# Altium project UC-526.PrjPCB (part 2 of 2)

## Sheet Cyusb3314_Interface.SchDoc
size 401 x 330 mm
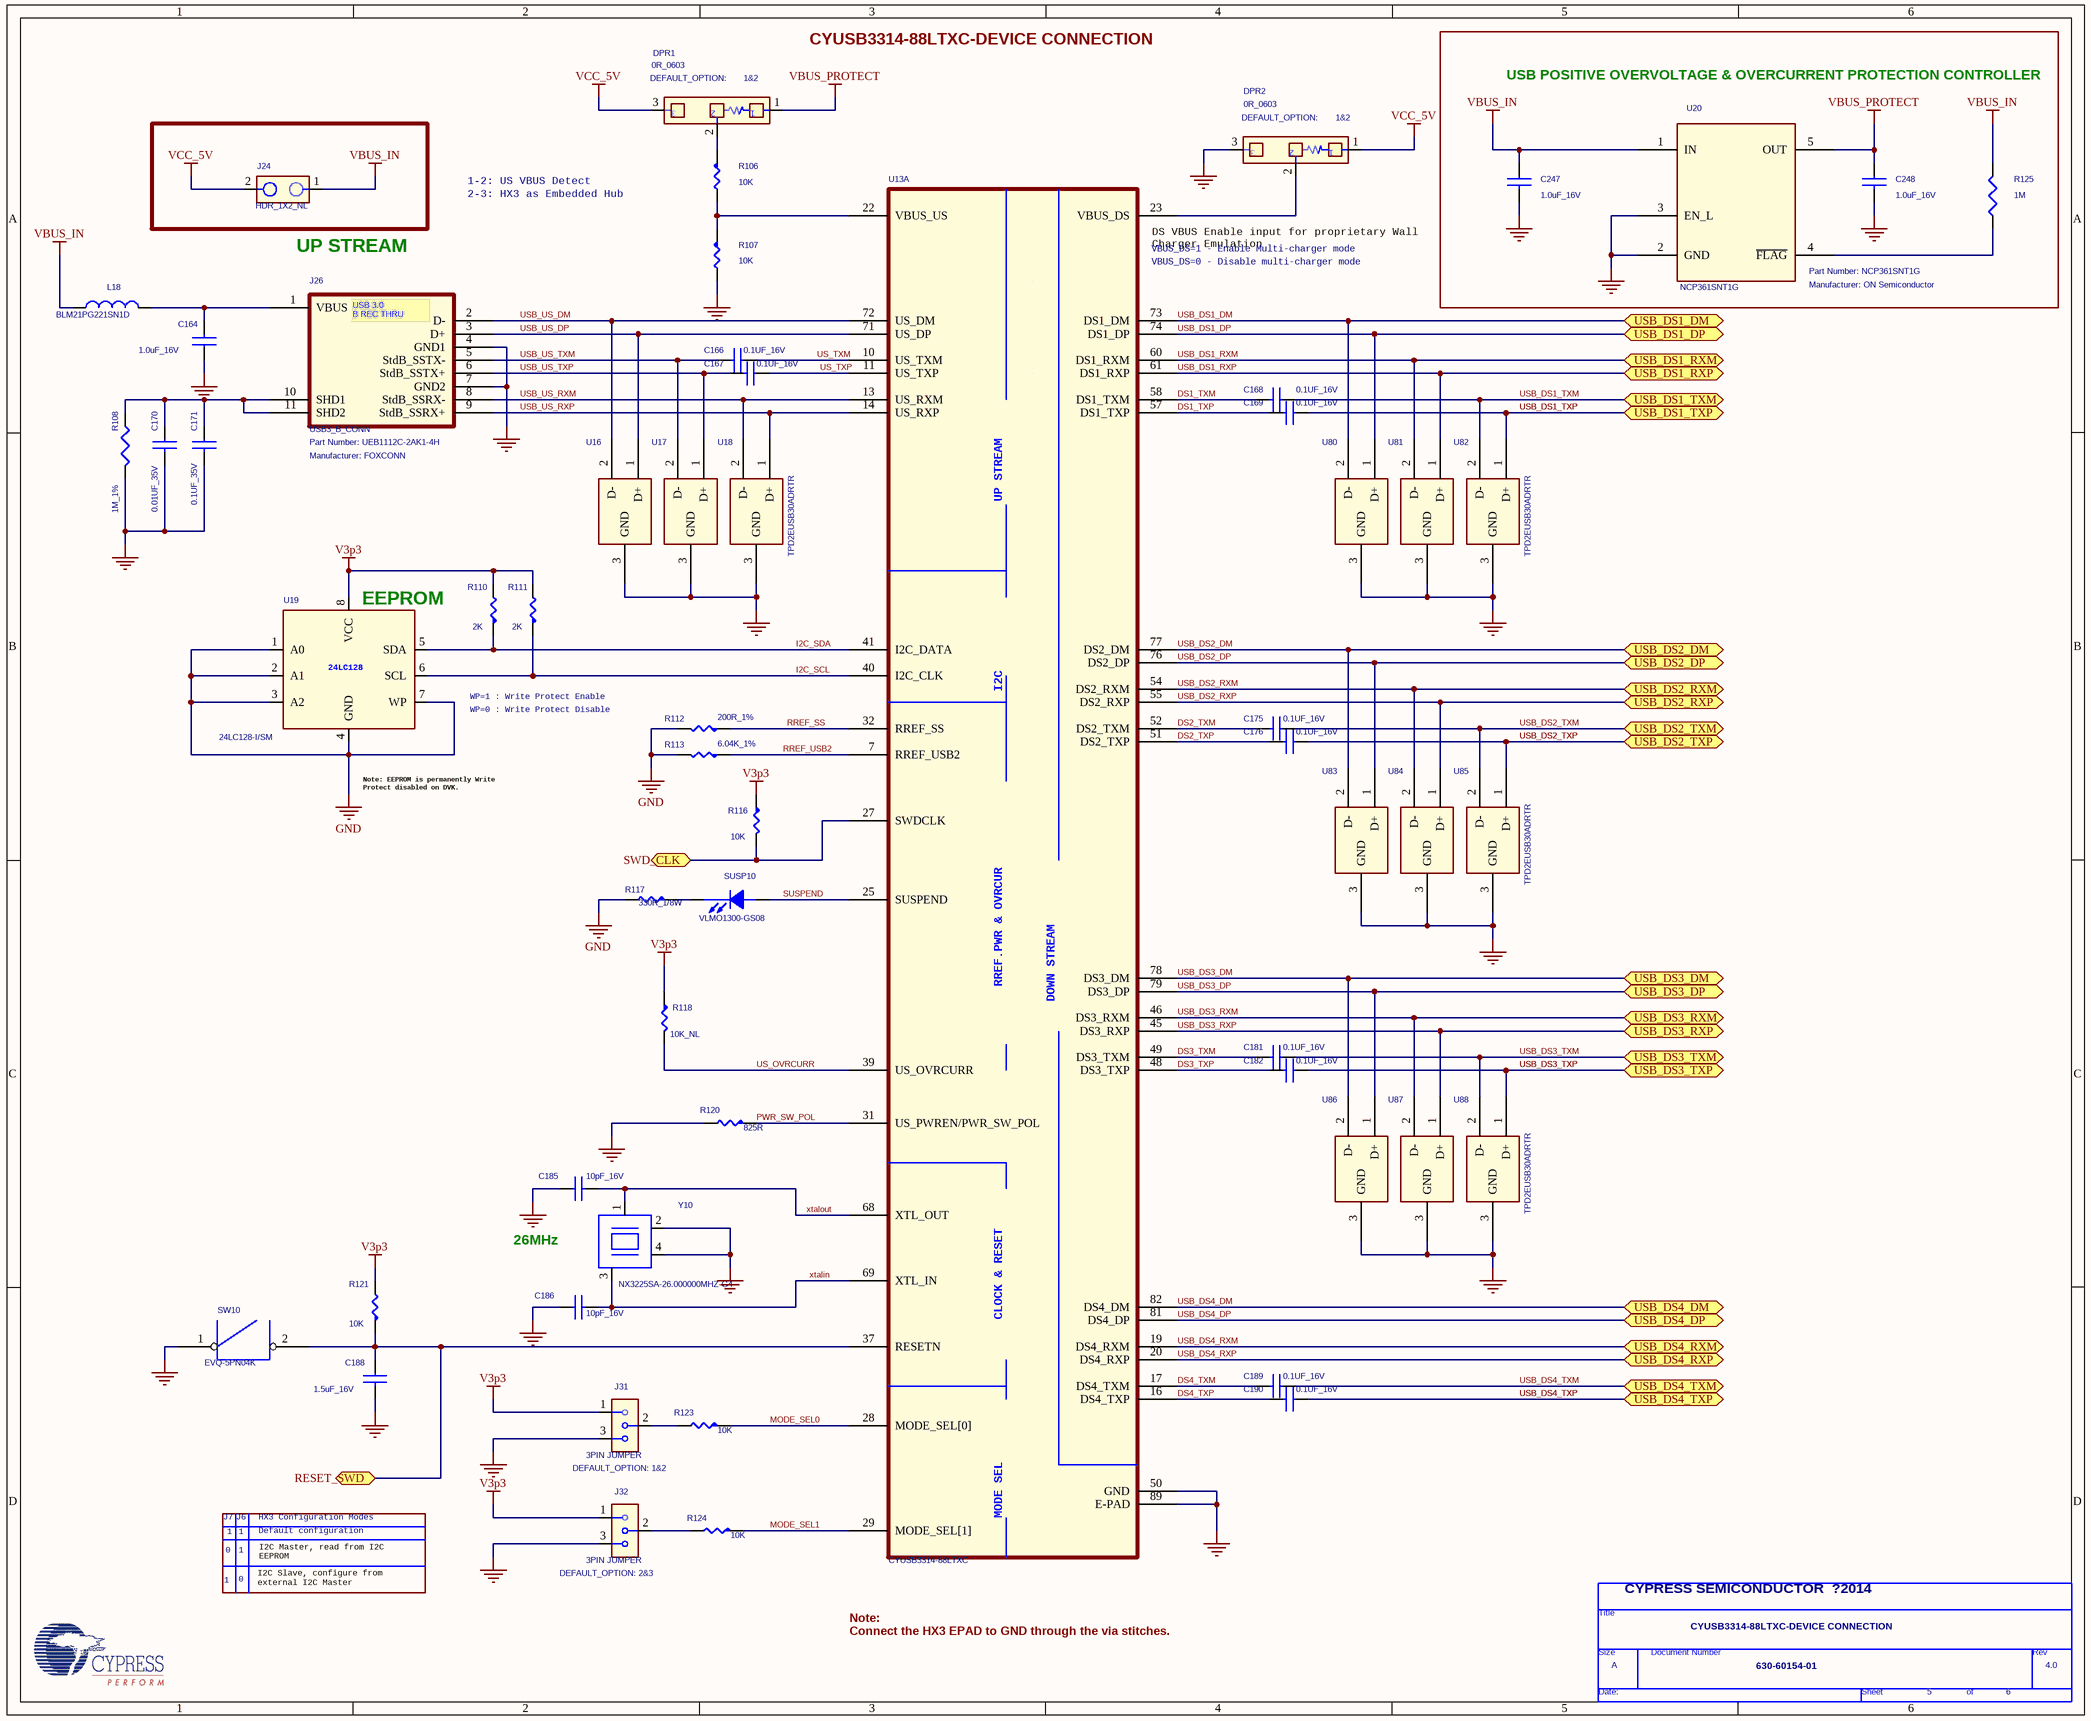
[diagram p5: Cyusb3314_Interface.SchDoc]

### Parts
(Parts that share a designator on the sheet are numbered #1, #2 ... from top to bottom, then left to right.)
*#2  Page Count: 6  Page Number: 5  Page Size: A  Title: CYUSB3314-88LTXC-DEVICE CONNECTION  RevCode: 4.0  Doc: 630-60154-01  (hidden comment: TitleBlock0)  (graphical)
C164  1.0uF_16V  [CAPC1005X56M]
C166  0.1UF_16V  [CAPC1005X56M]
C167  0.1UF_16V  [CAPC1005X56M]
C168  0.1UF_16V  [CAPC1005X56M]
C169  0.1UF_16V  [CAPC1005X56M]
C170  0.01UF_35V  [CAPC1005X55M]
C171  0.1UF_35V  [CAPC1005X55M]
C175  0.1UF_16V  [CAPC1005X56M]
C176  0.1UF_16V  [CAPC1005X56M]
C181  0.1UF_16V  [CAPC1005X56M]
C182  0.1UF_16V  [CAPC1005X56M]
C185  10pF_16V  [CAPC1608X90M]
C186  10pF_16V  [CAPC1608X90M]
C188  1.5uF_16V  [CAPC1608X90M]
C189  0.1UF_16V  [CAPC1005X56M]
C190  0.1UF_16V  [CAPC1005X56M]
C247  1.0uF_16V  [CAPC1608X90M]
C248  1.0uF_16V  [CAPC1608X90M]
DPR1  0R_0603  Mounting Status: 1&2  [RC0603_3P]
DPR2  0R_0603  Mounting Status: 1&2  [RC0603_3P]
J24  HDR_1X2_NL  [SAMTEC_TSW-102-08-G-S]
J26  USB3_B_CONN  Manufacturer: FOXCONN  [FOXCONN_UEB1112C-2AK1-4H]
J31  3PIN JUMPER  DEFAULT_OPTION: 1&2  [TE_3-644456-3]
J32  3PIN JUMPER  DEFAULT_OPTION: 2&3  [TE_3-644456-3]
L18  BLM21PG221SN1D  [INDC2012X105M]
R106  10K  [RESC1005X40M]
R107  10K  [RESC1005X40M]
R108  1M_1%  [RESC1608X55M]
R110  2K  [RESC1608X55M]
R111  2K  [RESC1608X55M]
R112  200R_1%  [RESC1608X50M]
R113  6.04K_1%  [RESC1608X55M_A]
R116  10K  [RESC1005X40M]
R117  330R_1/8W  [RESC1608X50M]
R118  10K_NL  [RESC1005X40M]
R120  825R  [RESC1005X40M]
R121  10K  [RESC1608X55M]
R123  10K  [RESC1005X40M]
R124  10K  [RESC1005X40M]
R125  1M  [RESC1005X40M]
SUSP10  VLMO1300-GS08  [LEDC1608X80M]
SW10  EVQ-5PN04K  [SW_EVQ-5PN04K]
U13  CYUSB3314-88LTXC  [QFN40P1000X1000X100-89M]  (part A of 3)
U16  TPD2EUSB30ADRTR  [SOTFL35P100X50-3M]  (value not drawn)
U17  TPD2EUSB30ADRTR  [SOTFL35P100X50-3M]  (value not drawn)
U18  TPD2EUSB30ADRTR  [SOTFL35P100X50-3M]
U19  24LC128-I/SM  [SOIC127P790X203-8M]
U20  NCP361SNT1G  Manufacturer: ON Semiconductor  [SOP95P275X110-5M]
U80  TPD2EUSB30ADRTR  [SOTFL35P100X50-3M]  (value not drawn)
U81  TPD2EUSB30ADRTR  [SOTFL35P100X50-3M]  (value not drawn)
U82  TPD2EUSB30ADRTR  [SOTFL35P100X50-3M]
U83  TPD2EUSB30ADRTR  [SOTFL35P100X50-3M]  (value not drawn)
U84  TPD2EUSB30ADRTR  [SOTFL35P100X50-3M]  (value not drawn)
U85  TPD2EUSB30ADRTR  [SOTFL35P100X50-3M]
U86  TPD2EUSB30ADRTR  [SOTFL35P100X50-3M]  (value not drawn)
U87  TPD2EUSB30ADRTR  [SOTFL35P100X50-3M]  (value not drawn)
U88  TPD2EUSB30ADRTR  [SOTFL35P100X50-3M]
Y10  NX3225SA-26.000000MHZ-G4  [OSCCC250X320X70-4M]

### Blocks framed on the sheet
USB POSITIVE OVERVOLTAGE & OVERCURRENT PROTECTION CONTROLLER: C247 C248 R125 U20

### Ports
RESET_SWD (bidir), SWD_CLK (bidir), USB_DS1_DM (bidir), USB_DS1_DP (bidir), USB_DS1_RXM (bidir), USB_DS1_RXP (bidir), USB_DS1_TXM (bidir), USB_DS1_TXP (bidir), USB_DS2_DM (bidir), USB_DS2_DP (bidir), USB_DS2_RXM (bidir), USB_DS2_RXP (bidir), USB_DS2_TXM (bidir), USB_DS2_TXP (bidir), USB_DS3_DM (bidir), USB_DS3_DP (bidir), USB_DS3_RXM (bidir), USB_DS3_RXP (bidir), USB_DS3_TXM (bidir), USB_DS3_TXP (bidir), USB_DS4_DM (bidir), USB_DS4_DP (bidir), USB_DS4_RXM (bidir), USB_DS4_RXP (bidir), USB_DS4_TXM (bidir), USB_DS4_TXP (bidir)

### Nets
GND: C164.1 C170.2 C171.2 C185.1 C186.1 C188.2 C247.2 C248.2 DPR2.3 J26.4(GND1) J26.7(GND2) J31.3 J32.3 R107.2 R108.2 R112.2 R113.2 R117.2 R120.2 SW10.1 U13.50(GND) U13.89(E-PAD) U16.3(GND) U17.3(GND) U18.3(GND) U19.1(A0) U19.2(A1) U19.3(A2) U19.4(GND) U19.7(WP) U20.2(GND) U20.3(EN_L) U80.3(GND) U81.3(GND) U82.3(GND) U83.3(GND) U84.3(GND) U85.3(GND) U86.3(GND) U87.3(GND) U88.3(GND) Y10.2 Y10.4
V3p3: J31.1 J32.1 R110.2 R111.2 R116.1 R118.1 R121.2 U19.8(VCC)  [project net SWD_IO]
VBUS_IN: C247.1 J24.1 L18.1 R125.2 U20.1(IN)
VBUS_PROTECT: C248.1 DPR1.1 U20.5(OUT)
VCC_5V: DPR1.3 DPR2.1 J24.2  [project net VCC(+5V)]
DS1_TXM: C168.2 U13.58(DS1_TXM)
DS1_TXP: C169.2 U13.57(DS1_TXP)
DS2_TXM: C175.2 U13.52(DS2_TXM)
DS2_TXP: C176.2 U13.51(DS2_TXP)
DS3_TXM: C181.2 U13.49(DS3_TXM)
DS3_TXP: C182.2 U13.48(DS3_TXP)
DS4_TXM: C189.2 U13.17(DS4_TXM)
DS4_TXP: C190.2 U13.16(DS4_TXP)
I2C_SCL: R111.1 U13.40(I2C_CLK) U19.6(SCL)
I2C_SDA: R110.1 U13.41(I2C_DATA) U19.5(SDA)
MODE_SEL0: R123.1 U13.28(MODE_SEL[0])
MODE_SEL1: R124.1 U13.29(MODE_SEL[1])
PWR_SW_POL: R120.1 U13.31(US_PWREN/PWR_SW_POL)
RREF_SS: R112.1 U13.32(RREF_SS)
RREF_USB2: R113.1 U13.7(RREF_USB2)
SUSPEND: SUSP10.1(ANODE) U13.25(SUSPEND)
US_OVRCURR: R118.2 U13.39(US_OVRCURR)
US_TXM: C166.1 U13.10(US_TXM)
US_TXP: C167.1 U13.11(US_TXP)
USB_DS1_DM: U13.73(DS1_DM) U80.2(D-) ; port USB_DS1_DM
USB_DS1_DP: U13.74(DS1_DP) U80.1(D+) ; port USB_DS1_DP
USB_DS1_RXM: U13.60(DS1_RXM) U81.2(D-) ; port USB_DS1_RXM
USB_DS1_RXP: U13.61(DS1_RXP) U81.1(D+) ; port USB_DS1_RXP
USB_DS1_TXM: C168.1 U82.2(D-) ; port USB_DS1_TXM
USB_DS1_TXP: C169.1 U82.1(D+) ; port USB_DS1_TXP
USB_DS2_DM: U13.77(DS2_DM) U83.2(D-) ; port USB_DS2_DM
USB_DS2_DP: U13.76(DS2_DP) U83.1(D+) ; port USB_DS2_DP
USB_DS2_RXM: U13.54(DS2_RXM) U84.2(D-) ; port USB_DS2_RXM
USB_DS2_RXP: U13.55(DS2_RXP) U84.1(D+) ; port USB_DS2_RXP
USB_DS2_TXM: C175.1 U85.2(D-) ; port USB_DS2_TXM
USB_DS2_TXP: C176.1 U85.1(D+) ; port USB_DS2_TXP
USB_DS3_DM: U13.78(DS3_DM) U86.2(D-) ; port USB_DS3_DM
USB_DS3_DP: U13.79(DS3_DP) U86.1(D+) ; port USB_DS3_DP
USB_DS3_RXM: U13.46(DS3_RXM) U87.2(D-) ; port USB_DS3_RXM
USB_DS3_RXP: U13.45(DS3_RXP) U87.1(D+) ; port USB_DS3_RXP
USB_DS3_TXM: C181.1 U88.2(D-) ; port USB_DS3_TXM
USB_DS3_TXP: C182.1 U88.1(D+) ; port USB_DS3_TXP
USB_DS4_DM: U13.82(DS4_DM) ; port USB_DS4_DM
USB_DS4_DP: U13.81(DS4_DP) ; port USB_DS4_DP  [project net USB_DS4_DM]
USB_DS4_RXM: U13.19(DS4_RXM) ; port USB_DS4_RXM
USB_DS4_RXP: U13.20(DS4_RXP) ; port USB_DS4_RXP
USB_DS4_TXM: C189.1 ; port USB_DS4_TXM
USB_DS4_TXP: C190.1 ; port USB_DS4_TXP
USB_US_DM: J26.2(D-) U13.72(US_DM) U16.2(D-)
USB_US_DP: J26.3(D+) U13.71(US_DP) U16.1(D+)
USB_US_RXM: J26.8(StdB_SSRX-) U13.13(US_RXM) U18.2(D-)
USB_US_RXP: J26.9(StdB_SSRX+) U13.14(US_RXP) U18.1(D+)
USB_US_TXM: C166.2 J26.5(StdB_SSTX-) U17.2(D-)
USB_US_TXP: C167.2 J26.6(StdB_SSTX+) U17.1(D+)
xtalin: C186.2 U13.69(XTL_IN) Y10.3
xtalout: C185.2 U13.68(XTL_OUT) Y10.1
NetC164_2: C164.2 J26.1(VBUS) L18.2
NetC170_1: C170.1 C171.1 J26.10(SHD1) J26.11(SHD2) R108.1
NetC188_1: C188.1 R121.1 SW10.2 U13.37(RESETN) ; port RESET_SWD
NetDPR1_2: DPR1.2 R106.1
NetDPR2_2: DPR2.2 U13.23(VBUS_DS)
NetJ11_4: R116.2 U13.27(SWDCLK) ; port SWD_CLK
NetJ31_2: J31.2 R123.2
NetJ32_2: J32.2 R124.2
NetR106_2: R106.2 R107.1 U13.22(VBUS_US)
NetR117_1: R117.1 SUSP10.2(CATHODE)
NetR125_1: R125.1 U20.4(~{FLAG})

### Notes on the sheet
- CYUSB3314-88LTXC-DEVICE CONNECTION
- 1-2: US VBUS Detect
- 2-3: HX3 as Embedded Hub
- UP STREAM
- (near U13) DS VBUS Enable input for proprietary Wall
  Charger Emulation
- (near U13) VBUS_DS=0 - Disable multi-charger mode
- (near U13) VBUS_DS=1 - Enable Multi-charger mode
- (near U19) EEPROM
- WP=1 : Write Protect Enable
- WP=0 : Write Protect Disable
- (near U19) Note: EEPROM is permanently Write
  Protect disabled on DVK.
- 26MHz
- J7
- 1
- J6
- HX3 Configuration Modes
- Default configuration
- 0
- I2C Slave, configure from
  external I2C Master
- I2C Master, read from I2C
  EEPROM
- (near *#2) CYPRESS SEMICONDUCTOR  ?2014
- Note:
  Connect the HX3 EPAD to GND through the via stitches.
- (in symbol CYUSB3314-88LTXC_2, part A) UP STREAM; I2C; RREF.PWR & OVRCUR; DOWN STREAM; CLOCK & RESET; MODE SEL
- (in symbol TitleBlock0) Title; Size; Document Number; Rev; Date:; Sheet; of
- (in symbol UEB1112C-2AK1-4H) USB 3.0 / B REC THRU

### Library data of the parts
C164 C166-C169 C175 C176 C181 C182 C185 C186 C189 C190 = CAPACITOR NON-POL
  C164 C175 C176 C189 C190: Manufacturer: *; Part Number: *
  C181: Manufacturer: *
C170 = CAPACITOR NON-POL: Part Number: C1005X7R1V103M050BB; Manufacturer: *
C171 = CAPACITOR NON-POL: Part Number: C1005X7R1V104K050BB
C188 = CAPACITOR NON-POL: CAP CER 1.5UF 10V 10% X7R 0805; Manufacturer: TDK Corporation; Lead Free: YES
C247 C248 = CAP: CAP - CER, 1uF, 10V, +/-10%, X5R, 0402; Part Class: CAPACITORS; Num Pins: 2; Item Num: P03-15479R; RoHS Compliant: Yes; Lead Free Status: Yes
DPR1 DPR2 = DPR12_0: Resistor, 4.7K, 0402, 1/10W, 5%; Part Number: ERJ-2GEJ472X
J24 = HEADER_1x2: Manufacturer: Samtec Inc; Part Number: TSW-102-08-G-S; Lead Free: YES
J26 = UEB1112C-2AK1-4H: USB 3.0 B Series Right Angle,T/H 9 Pos; Lead Free: YES; Part Number: UEB1112C-2AK1-4H
J31 J32 = 3PIN JUM: CONN HEADER VERT 3POS .100 TIN; Part Number: 3-644456-3; Manufacturer: Tyco Electronics; Type: Single Row,3Pin Header
L18 = INDUCTOR: FERRITE CHIP 220 OHM 2A 0805; Manufacturer: Murata; Lead Free: YES; Part Number: BLM21PG221SN1D
R106 = R_Dup1: Manufacturer: Panasonic; Part Number: ERJ-2GE0R00X
R107 = R_Dup1: Part Number: ERJ-2RKF4990X; Manufacturer: Panasonic
R108 = R: RES 1M OHM 1/10W 1% 0603 SMD; Part Number: ERJ-3EKF1004V; Manufacturer: Panasonic
R110 = R_Dup1: RES 2.00K OHM 1/10W 1% 0603 SMD; Manufacturer: Rohm Semiconductor; Part Number: MCR03EZPFX2001; Lead Free: YES
R111 = R_Dup1: RES 2.00K OHM 1/10W 1% 0603 SMD; Part Number: MCR03EZPFX2001; Manufacturer: Rohm Semiconductor; Lead Free: YES
R112 = R_Dup1: RES 200 OHM 1% 0603 SMD; Manufacturer: Stackpole; Part Number: RNCP0603FTD200R
R113 = R_Dup1: RES 6.04K OHM .25W 1% 0603 SMD; Part Number: CRCW06036K04FKEAHP; Manufacturer: Vishay Dale
R116 = R_Dup1: RES 10.0K OHM 1/10W 1% 0603 SMD; Manufacturer: Panasonic - ECG; Part Number: ERJ-3EKF1002V; Lead Free: YES
R117 = R_Dup1: Lead Free: YES
R118 = R_Dup1: RES 10.0K OHM 1/10W 1% 0603 SMD; Part Number: ERJ-3EKF1002V; Manufacturer: Panasonic - ECG; Lead Free: YES
R120 R123 R124 = R_Dup1: Manufacturer: Panasonic; Part Number: ERJ-2RKF49.9X
R121 = R_Dup1: Part Number: ERJ-2RKF49.9X; Manufacturer: Panasonic
R125 = R: RES 1.00M OHM 1/10W 1% 0402 SMD; Manufacturer: Panasonic; Part Number: ERJ-2RKF1004X
SUSP10 = LED: Part Number: VLMO1300-GS08
SW10 = B3U1000P: Part Number: EVQ-5PN04K
U13 = CYUSB3314-88LTXC_2: Part Number: CYUSB3314-88LTXC
U19 = 24LC128: IC EEPROM 128KBIT 400KHZ 8SOIC; Manufacturer: Microchip Technology; Lead Free: YES; Part Number: 24LC128-I/SM
U20 = NCP361SNT1G_0: IC USB POS OVP/OC_TSOP5; Part Number: NCP361SNT1G
Y10 = CRYSTAL_1: Manufacturer: NDK; Part Number: NX3225SA-26.000000MHZ-G4
*#2 = TitleBlock0: Page Create Date: March  8, 1995
U16-U18 U80-U88 = TPD2EUSB30ADRTR: Part Number: TPD2EUSB30ADRTR

## Sheet Cyusb3314_Power.SchDoc
size 386 x 284 mm
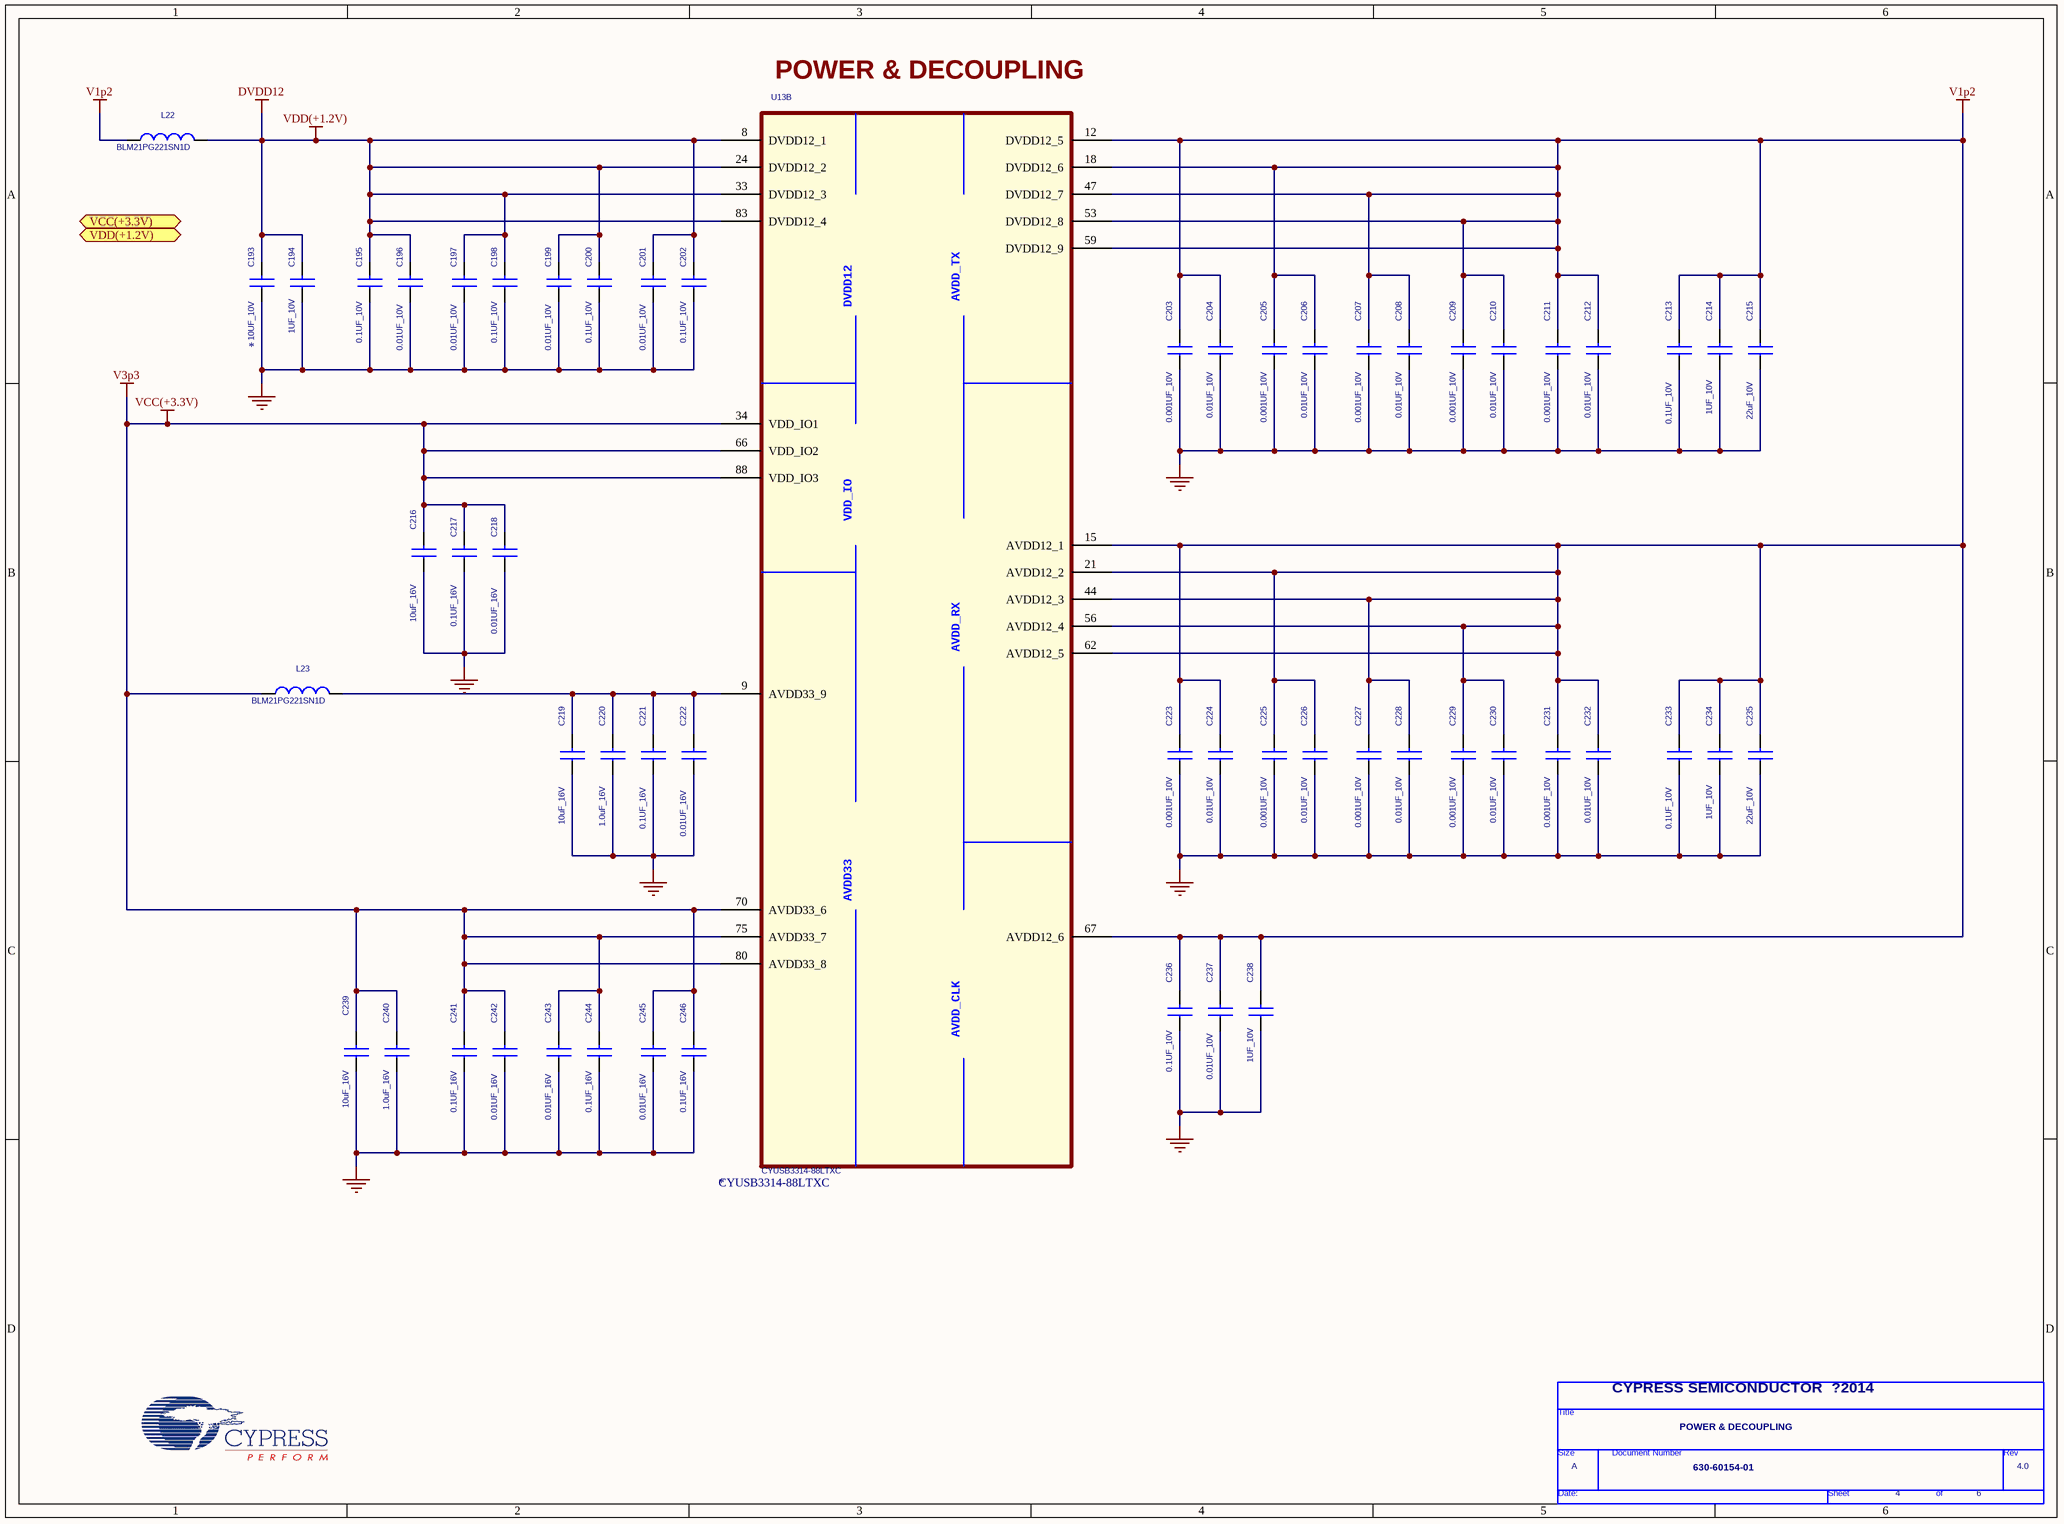
[diagram p6: Cyusb3314_Power.SchDoc]

### Parts
(Parts that share a designator on the sheet are numbered #1, #2 ... from top to bottom, then left to right.)
*#3  Page Count: 6  Page Number: 4  Page Size: A  Title: POWER & DECOUPLING  RevCode: 4.0  Doc: 630-60154-01  (hidden comment: TitleBlock0)  (graphical)
C193  10UF_10V  [CAPC1608X90M]
C194  1UF_10V  [CAPC1005X56M]
C195  0.1UF_10V  [CAPC1005X56M]
C196  0.01UF_10V  [CAPC1005X56M]
C197  0.01UF_10V  [CAPC1005X56M]
C198  0.1UF_10V  [CAPC1005X56M]
C199  0.01UF_10V  [CAPC1005X56M]
C200  0.1UF_10V  [CAPC1005X56M]
C201  0.01UF_10V  [CAPC1005X56M]
C202  0.1UF_10V  [CAPC1005X56M]
C203  0.001UF_10V  [CAPC1005X56M]
C204  0.01UF_10V  [CAPC1005X56M]
C205  0.001UF_10V  [CAPC1005X56M]
C206  0.01UF_10V  [CAPC1005X56M]
C207  0.001UF_10V  [CAPC1005X56M]
C208  0.01UF_10V  [CAPC1005X56M]
C209  0.001UF_10V  [CAPC1005X56M]
C210  0.01UF_10V  [CAPC1005X56M]
C211  0.001UF_10V  [CAPC1005X56M]
C212  0.01UF_10V  [CAPC1005X56M]
C213  0.1UF_10V  [CAPC1005X56M]
C214  1UF_10V  [CAPC1005X56M]
C215  22uF_10V  [CAPC1608X90M]
C216  10uF_16V  [CAPC1608X90M]
C217  0.1UF_16V  [CAPC1005X56M]
C218  0.01UF_16V  [CAPC1005X56M]
C219  10uF_16V  [CAPC1608X90M]
C220  1.0uF_16V  [CAPC1005X56M]
C221  0.1UF_16V  [CAPC1005X56M]
C222  0.01UF_16V  [CAPC1005X56M]
C223  0.001UF_10V  [CAPC1005X56M]
C224  0.01UF_10V  [CAPC1005X56M]
C225  0.001UF_10V  [CAPC1005X56M]
C226  0.01UF_10V  [CAPC1005X56M]
C227  0.001UF_10V  [CAPC1005X56M]
C228  0.01UF_10V  [CAPC1005X56M]
C229  0.001UF_10V  [CAPC1005X56M]
C230  0.01UF_10V  [CAPC1005X56M]
C231  0.001UF_10V  [CAPC1005X56M]
C232  0.01UF_10V  [CAPC1005X56M]
C233  0.1UF_10V  [CAPC1005X56M]
C234  1UF_10V  [CAPC1005X56M]
C235  22uF_10V  [CAPC1608X90M]
C236  0.1UF_10V  [CAPC1005X56M]
C237  0.01UF_10V  [CAPC1005X56M]
C238  1UF_10V  [CAPC1005X56M]
C239  10uF_16V  [CAPC1608X90M]
C240  1.0uF_16V  [CAPC1005X56M]
C241  0.1UF_16V  [CAPC1005X56M]
C242  0.01UF_16V  [CAPC1005X56M]
C243  0.01UF_16V  [CAPC1005X56M]
C244  0.1UF_16V  [CAPC1005X56M]
C245  0.01UF_16V  [CAPC1005X56M]
C246  0.1UF_16V  [CAPC1005X56M]
L22  BLM21PG221SN1D  [INDC2012X105M]
L23  BLM21PG221SN1D  [INDC2012X105M]
U13  CYUSB3314-88LTXC  [QFN40P1000X1000X100-89M]  (part B of 3)

### Ports
VCC(+3.3V) (in), VDD(+1.2V) (in)

### Nets
DVDD12: C193.2 C194.2 C195.2 C196.2 C197.2 C198.2 C199.2 C200.2 C201.2 C202.2 C203.2 C204.2 C205.2 C206.2 C207.2 C208.2 C209.2 C210.2 C211.2 C212.2 C213.2 C214.2 C215.2 C223.2 C224.2 C225.2 C226.2 C227.2 C228.2 C229.2 C230.2 C231.2 C232.2 C233.2 C234.2 C235.2 C236.2 C237.2 C238.2 L22.1 L22.2 U13.8(DVDD12_1) U13.12(DVDD12_5) U13.15(AVDD12_1) U13.18(DVDD12_6) U13.21(AVDD12_2) U13.24(DVDD12_2) U13.33(DVDD12_3) U13.44(AVDD12_3) U13.47(DVDD12_7) U13.53(DVDD12_8) U13.56(AVDD12_4) U13.59(DVDD12_9) U13.62(AVDD12_5) U13.67(AVDD12_6) U13.83(DVDD12_4)  [also labelled V1p2, VDD(+1.2V)]
GND: C193.1 C194.1 C195.1 C196.1 C197.1 C198.1 C199.1 C200.1 C201.1 C202.1 C203.1 C204.1 C205.1 C206.1 C207.1 C208.1 C209.1 C210.1 C211.1 C212.1 C213.1 C214.1 C215.1 C216.1 C217.1 C218.1 C219.1 C220.1 C221.1 C222.1 C223.1 C224.1 C225.1 C226.1 C227.1 C228.1 C229.1 C230.1 C231.1 C232.1 C233.1 C234.1 C235.1 C236.1 C237.1 C238.1 C239.1 C240.1 C241.1 C242.1 C243.1 C244.1 C245.1 C246.1
V3p3: C216.2 C217.2 C218.2 C239.2 C240.2 C241.2 C242.2 C243.2 C244.2 C245.2 C246.2 L23.1 U13.34(VDD_IO1) U13.66(VDD_IO2) U13.70(AVDD33_6) U13.75(AVDD33_7) U13.80(AVDD33_8) U13.88(VDD_IO3)  [also labelled VCC(+3.3V)]  [project net SWD_IO]
NetC219_2: C219.2 C220.2 C221.2 C222.2 L23.2 U13.9(AVDD33_9)

### Notes on the sheet
- POWER & DECOUPLING
- CYPRESS SEMICONDUCTOR  ?2014
- (in symbol CYUSB3314-88LTXC_2, part B) AVDD_TX; DVDD12; VDD_IO; AVDD_RX; AVDD33; AVDD_CLK
- (in symbol TitleBlock0) Title; Size; Document Number; Rev; Date:; Sheet; of

### Library data of the parts
C193-C246 = CAPACITOR NON-POL: Manufacturer: *; Part Number: *
  C196: Decription: *
L22 L23 = INDUCTOR: FERRITE CHIP 220 OHM 2A 0805; Manufacturer: Murata; DEVICE: L4; Part Number: BLM21PG221SN1D; Lead Free: YES
U13 = CYUSB3314-88LTXC_2: Manufacturer: *; Part Number: CYUSB3314-88LTXC
*#3 = TitleBlock0: Page Create Date: March  8, 1995

## Sheet LED_Driver - 1.SchDoc
size A3
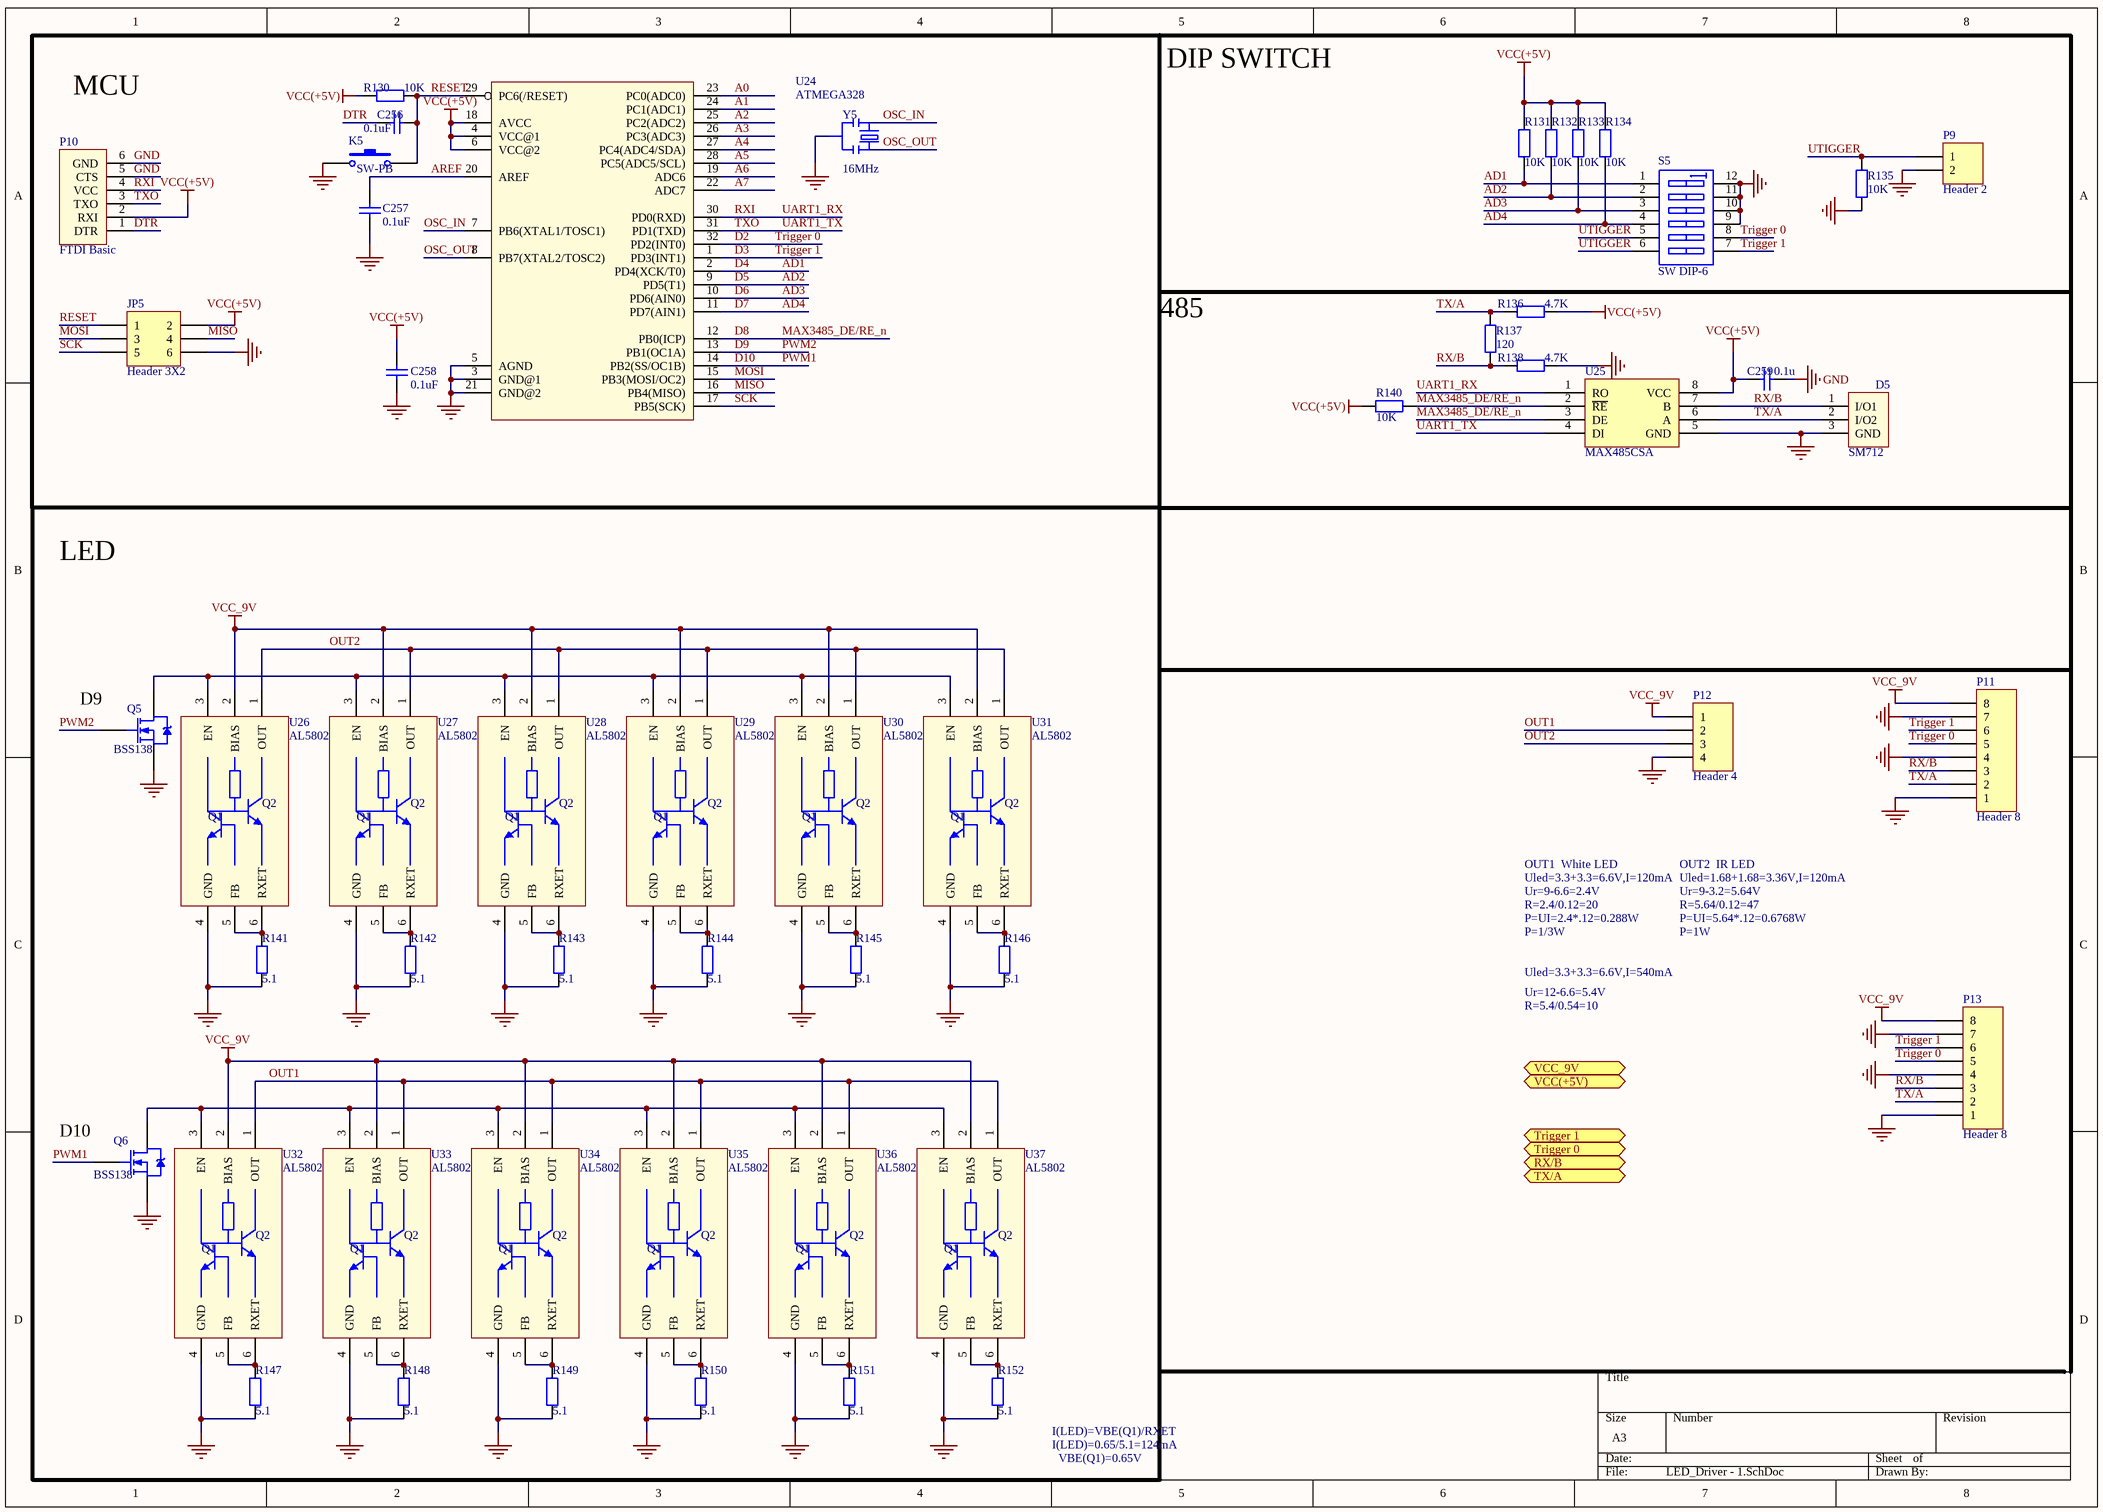
[diagram p7: LED_Driver - 1.SchDoc]

### Parts
C256  0.1uF  [C0603]
C257  0.1uF  [C0603]
C258  0.1uF  [C0603]
C259  0.1u  [C0603]
D5  SM712  [SOT23-3]
JP5  Header 3X2  [MHDR1X6]
K5  SW-PB  [157SW]
P9  Header 2  [HDR1X2]
P10  FTDI Basic  [MHDR1X6]
P11  Header 8  [SH_1.25MM*8]
P12  Header 4  [SMT_1.25MM*4]
P13  Header 8  [SH_1.25MM*8]
Q5  BSS138  [SOT-23 (Standard)]
Q6  BSS138  [SOT-23 (Standard)]
R130  10K  [R0603]
R131  10K  [R0603]
R132  10K  [R0603]
R133  10K  [R0603]
R134  10K  [R0603]
R135  10K  [R0603]
R136  4.7K  [R0603]
R137  120  [R0603]
R138  4.7K  [R0603]
R140  10K  [R0603]
R141  5.1  [R0603]
R142  5.1  [R0603]
R143  5.1  [R0603]
R144  5.1  [R0603]
R145  5.1  [R0603]
R146  5.1  [R0603]
R147  5.1  [R0603]
R148  5.1  [R0603]
R149  5.1  [R0603]
R150  5.1  [R0603]
R151  5.1  [R0603]
R152  5.1  [R0603]
S5  SW DIP-6  [DIP_SW_6WAY_SMD]
U24  ATMEGA328  [TQFP32-08]
U25  MAX485CSA  [SOIC-8]
U26  AL5802  [SOT26]
U27  AL5802  [SOT26]
U28  AL5802  [SOT26]
U29  AL5802  [SOT26]
U30  AL5802  [SOT26]
U31  AL5802  [SOT26]
U32  AL5802  [SOT26]
U33  AL5802  [SOT26]
U34  AL5802  [SOT26]
U35  AL5802  [SOT26]
U36  AL5802  [SOT26]
U37  AL5802  [SOT26]
Y5  16MHz  [RESONATOR-SMD]

### Blocks framed on the sheet
LED: Q5 Q6 R141-R152 U26-U37

### Ports
RX/B (bidir), Trigger 0 (bidir), Trigger 1 (bidir), TX/A (bidir), VCC(+5V) (in), VCC_9V (bidir)

### Nets
GND: C257.1 C258.2 C259.1 D5.3(GND) JP5.6 K5.1 P9.2 P10.5(CTS) P10.6(GND) P11.1 P11.4 P11.7 P12.4 P13.1 P13.4 P13.7 Q5.S Q6.S R135.1 R138.1 R141.2 R142.2 R143.2 R144.2 R145.2 R146.2 R147.2 R148.2 R149.2 R150.2 R151.2 R152.2 S5.9(B4) S5.10(B3) S5.11(B2) S5.12(B1) U24.3(GND@1) U24.5(AGND) U24.21(GND@2) U25.5(GND) U26.4(GND) U27.4(GND) U28.4(GND) U29.4(GND) U30.4(GND) U31.4(GND) U32.4(GND) U33.4(GND) U34.4(GND) U35.4(GND) U36.4(GND) U37.4(GND) Y5.2
VCC(+5V): C258.1 C259.2 JP5.2 P10.2(RXI) R130.1 R131.1 R132.1 R133.1 R134.1 R136.1 R140.2 U24.4(VCC@1) U24.6(VCC@2) U24.18(AVCC) U25.8(VCC)
VCC_9V: P11.8 P12.1 P13.8 U26.2(BIAS) U27.2(BIAS) U28.2(BIAS) U29.2(BIAS) U30.2(BIAS) U31.2(BIAS) U32.2(BIAS) U33.2(BIAS) U34.2(BIAS) U35.2(BIAS) U36.2(BIAS) U37.2(BIAS)
A0: U24.23(PC0(ADC0))
A1: U24.24(PC1(ADC1))
A2: U24.25(PC2(ADC2))
A3: U24.26(PC3(ADC3))
A4: U24.27(PC4(ADC4/SDA))
A5: U24.28(PC5(ADC5/SCL))
A6: U24.19(ADC6)
A7: U24.22(ADC7)
AD1: R131.2 S5.1(A1) U24.2(PD4(XCK/T0))  [also labelled D4]
AD2: R132.2 S5.2(A2) U24.9(PD5(T1))  [also labelled D5]
AD3: R133.2 S5.3(A3) U24.10(PD6(AIN0))  [also labelled D6]
AD4: R134.2 S5.4(A4) U24.11(PD7(AIN1))  [also labelled D7]
AREF: C257.2 U24.20(AREF)
D2: P11.5 P13.5 S5.8(B5) U24.32(PD2(INT0))  [also labelled Trigger 0]
D3: P11.6 P13.6 S5.7(B6) U24.1(PD3(INT1))  [also labelled Trigger 1]
D8: R140.1 U24.12(PB0(ICP)) U25.2(~{RE}) U25.3(DE)  [also labelled MAX3485_DE/RE_n]
D9: Q5.G U24.13(PB1(OC1A))  [also labelled PWM2]
D10: Q6.G U24.14(PB2(SS/OC1B))  [also labelled PWM1]
DTR: C256.1 P10.1(DTR)
MISO: JP5.4 U24.16(PB4(MISO))
MOSI: JP5.3 U24.15(PB3(MOSI/OC2))
OSC_IN: U24.7(PB6(XTAL1/TOSC1)) Y5.3
OSC_OUT: U24.8(PB7(XTAL2/TOSC2)) Y5.1
OUT1: P12.2 U32.1(OUT) U33.1(OUT) U34.1(OUT) U35.1(OUT) U36.1(OUT) U37.1(OUT)
OUT2: P12.3 U26.1(OUT) U27.1(OUT) U28.1(OUT) U29.1(OUT) U30.1(OUT) U31.1(OUT)
RESET: C256.2 JP5.1 K5.2 R130.2 U24.29(PC6(/RESET))
RX/B: D5.1(I/O1) P11.3 P13.3 R137.2 R138.2 U25.7(B)
RXI: P10.4(VCC) U24.30(PD0(RXD)) U25.1(RO)  [also labelled UART1_RX]
SCK: JP5.5 U24.17(PB5(SCK))
TX/A: D5.2(I/O2) P11.2 P13.2 R136.2 R137.1 U25.6(A)
TXO: P10.3(TXO) U24.31(PD1(TXD)) U25.4(DI)  [also labelled UART1_TX]
UTIGGER: P9.1 R135.2 S5.5(A5) S5.6(A6)
NetQ5_D: Q5.D U26.3(EN) U27.3(EN) U28.3(EN) U29.3(EN) U30.3(EN) U31.3(EN)
NetQ6_D: Q6.D U32.3(EN) U33.3(EN) U34.3(EN) U35.3(EN) U36.3(EN) U37.3(EN)
NetR141_1: R141.1 U26.5(FB) U26.6(RXET)
NetR142_1: R142.1 U27.5(FB) U27.6(RXET)
NetR143_1: R143.1 U28.5(FB) U28.6(RXET)
NetR144_1: R144.1 U29.5(FB) U29.6(RXET)
NetR145_1: R145.1 U30.5(FB) U30.6(RXET)
NetR146_1: R146.1 U31.5(FB) U31.6(RXET)
NetR147_1: R147.1 U32.5(FB) U32.6(RXET)
NetR148_1: R148.1 U33.5(FB) U33.6(RXET)
NetR149_1: R149.1 U34.5(FB) U34.6(RXET)
NetR150_1: R150.1 U35.5(FB) U35.6(RXET)
NetR151_1: R151.1 U36.5(FB) U36.6(RXET)
NetR152_1: R152.1 U37.5(FB) U37.6(RXET)

### Notes on the sheet
- MCU
- DIP SWITCH
- 485
- (near Q5) D9
- Uled=3.3+3.3=6.6V,I=120mA
- OUT1  White LED
- R=2.4/0.12=20
- P=UI=2.4*.12=0.288W
- Ur=9-6.6=2.4V
- Uled=1.68+1.68=3.36V,I=120mA
- OUT2  IR LED
- R=5.64/0.12=47
- P=UI=5.64*.12=0.6768W
- Ur=9-3.2=5.64V
- P=1/3W
- Uled=3.3+3.3=6.6V,I=540mA
- Ur=12-6.6=5.4V
- P=1W
- R=5.4/0.54=10
- (near Q6) D10
- I(LED)=VBE(Q1)/RXET
- I(LED)=0.65/5.1=124mA
- VBE(Q1)=0.65V
- (in symbol AL5802) Q2; Q1

### Library data of the parts
C256-C258 = CAP SMT C100nF25V10%X7R: Capacitor; Voltage: 25V; iPartNumber: C100nF25V10%X7R; Value: 0.1uF
C259 = Cap: Capacitor; Value: 100pF; Published: 8-Jun-2000; LatestRevisionDate: 17-Jul-2002; LatestRevisionNote: Re-released for DXP Platform.; PackageReference: RAD-0.3; Publisher: Altium Limited
JP5 = Header 3X2: Header, 3-Pin, Dual row; LatestRevisionDate: 17-Jul-2002; LatestRevisionNote: Re-released for DXP Platform.; Publisher: Altium Limited
K5 = SW-PB: Switch; Published: 24-Mar-1999; LatestRevisionDate: 17-Jul-2002; LatestRevisionNote: Re-released for DXP Platform.; PackageReference: SPST-2; Publisher: Altium Limited; PackageDescription: Switch; 2 Leads
P9 = Header 2: Header, 2-Pin; LatestRevisionDate: 17-Jul-2002; LatestRevisionNote: Re-released for DXP Platform.; Publisher: Altium Limited
P10 = ARDUINO_SERIAL_PROGRAMPTH
P11 P13 = Header 8: Header, 8-Pin; LatestRevisionDate: 17-Jul-2002; LatestRevisionNote: Re-released for DXP Platform.; Publisher: Altium Limited
P12 = Header 4: Header, 4-Pin; LatestRevisionDate: 17-Jul-2002; LatestRevisionNote: Re-released for DXP Platform.; Publisher: Altium Limited
Q5 Q6 = NMOS: Manufacturer: Fairchild Semiconductor; Manufacturer Part Number: BSS123; FET Type: MOSFET N-Channel, Metal Oxide; FET Feature: Logic Level Gate; Drain to Source Voltage (Vdss): 100V; Current - Continuous Drain (Id) @ 25°C: 170mA (Ta); Rds On (Max) @ Id, Vgs: 6 Ohm @ 170mA, 10V; Vgs(th) (Max) @ Id: 2V @ 1mA; Gate Charge (Qg) @ Vgs: 2.5nC @ 10V; Input Capacitance (Ciss) @ Vds: 73pF @ 25V; Power - Max: 360mW; Supplier 1: Digi-Key; Supplier Part Number 1: BSS123NCT-ND; RoHS: RoHS Compliant; Category: Discrete Semiconductor Products; Stock 1: 163946; Pricing 1: 1=0.24, 10=0.216, 25=0.1556, 100=0.1211, 250=0.07612, 500=0.06484, 1000=0.04418 (USD); Packaging: Cut Tape (CT); Mounting Type: Surface Mount; Package / Case: TO-236-3, SC-59, SOT-23-3; Supplier Device Package: SOT-23; ComponentLink1URL: http://www.fairchildsemi.com/datasheets/BS/BSS123.pdf; ComponentLink1Description: http://www.fairchildsemi.com/datasheets/BS/BSS123.pdf
R130-R134 R136-R138 R140-R152 = Res2: Resistor
R135 = Res2: Resistor; Value: 1k; Published: 8-Jun-2000; LatestRevisionDate: 17-Jul-2002; LatestRevisionNote: Re-released for DXP Platform.; PackageReference: AXIAL-0.4; Publisher: Altium Limited
S5 = SW DIP-6: DIP Switch, 6 Position, SPST; Published: 24-Mar-1999; LatestRevisionDate: 17-Jul-2002; LatestRevisionNote: Re-released for DXP Platform.; PackageReference: DIP-12/SW; Publisher: Altium Limited
U24 = ATMEGA168
U25 = MAX3485CSA
Y5 = RESONATORSMD

## Sheet LED_Driver - 2.SchDoc
size A3
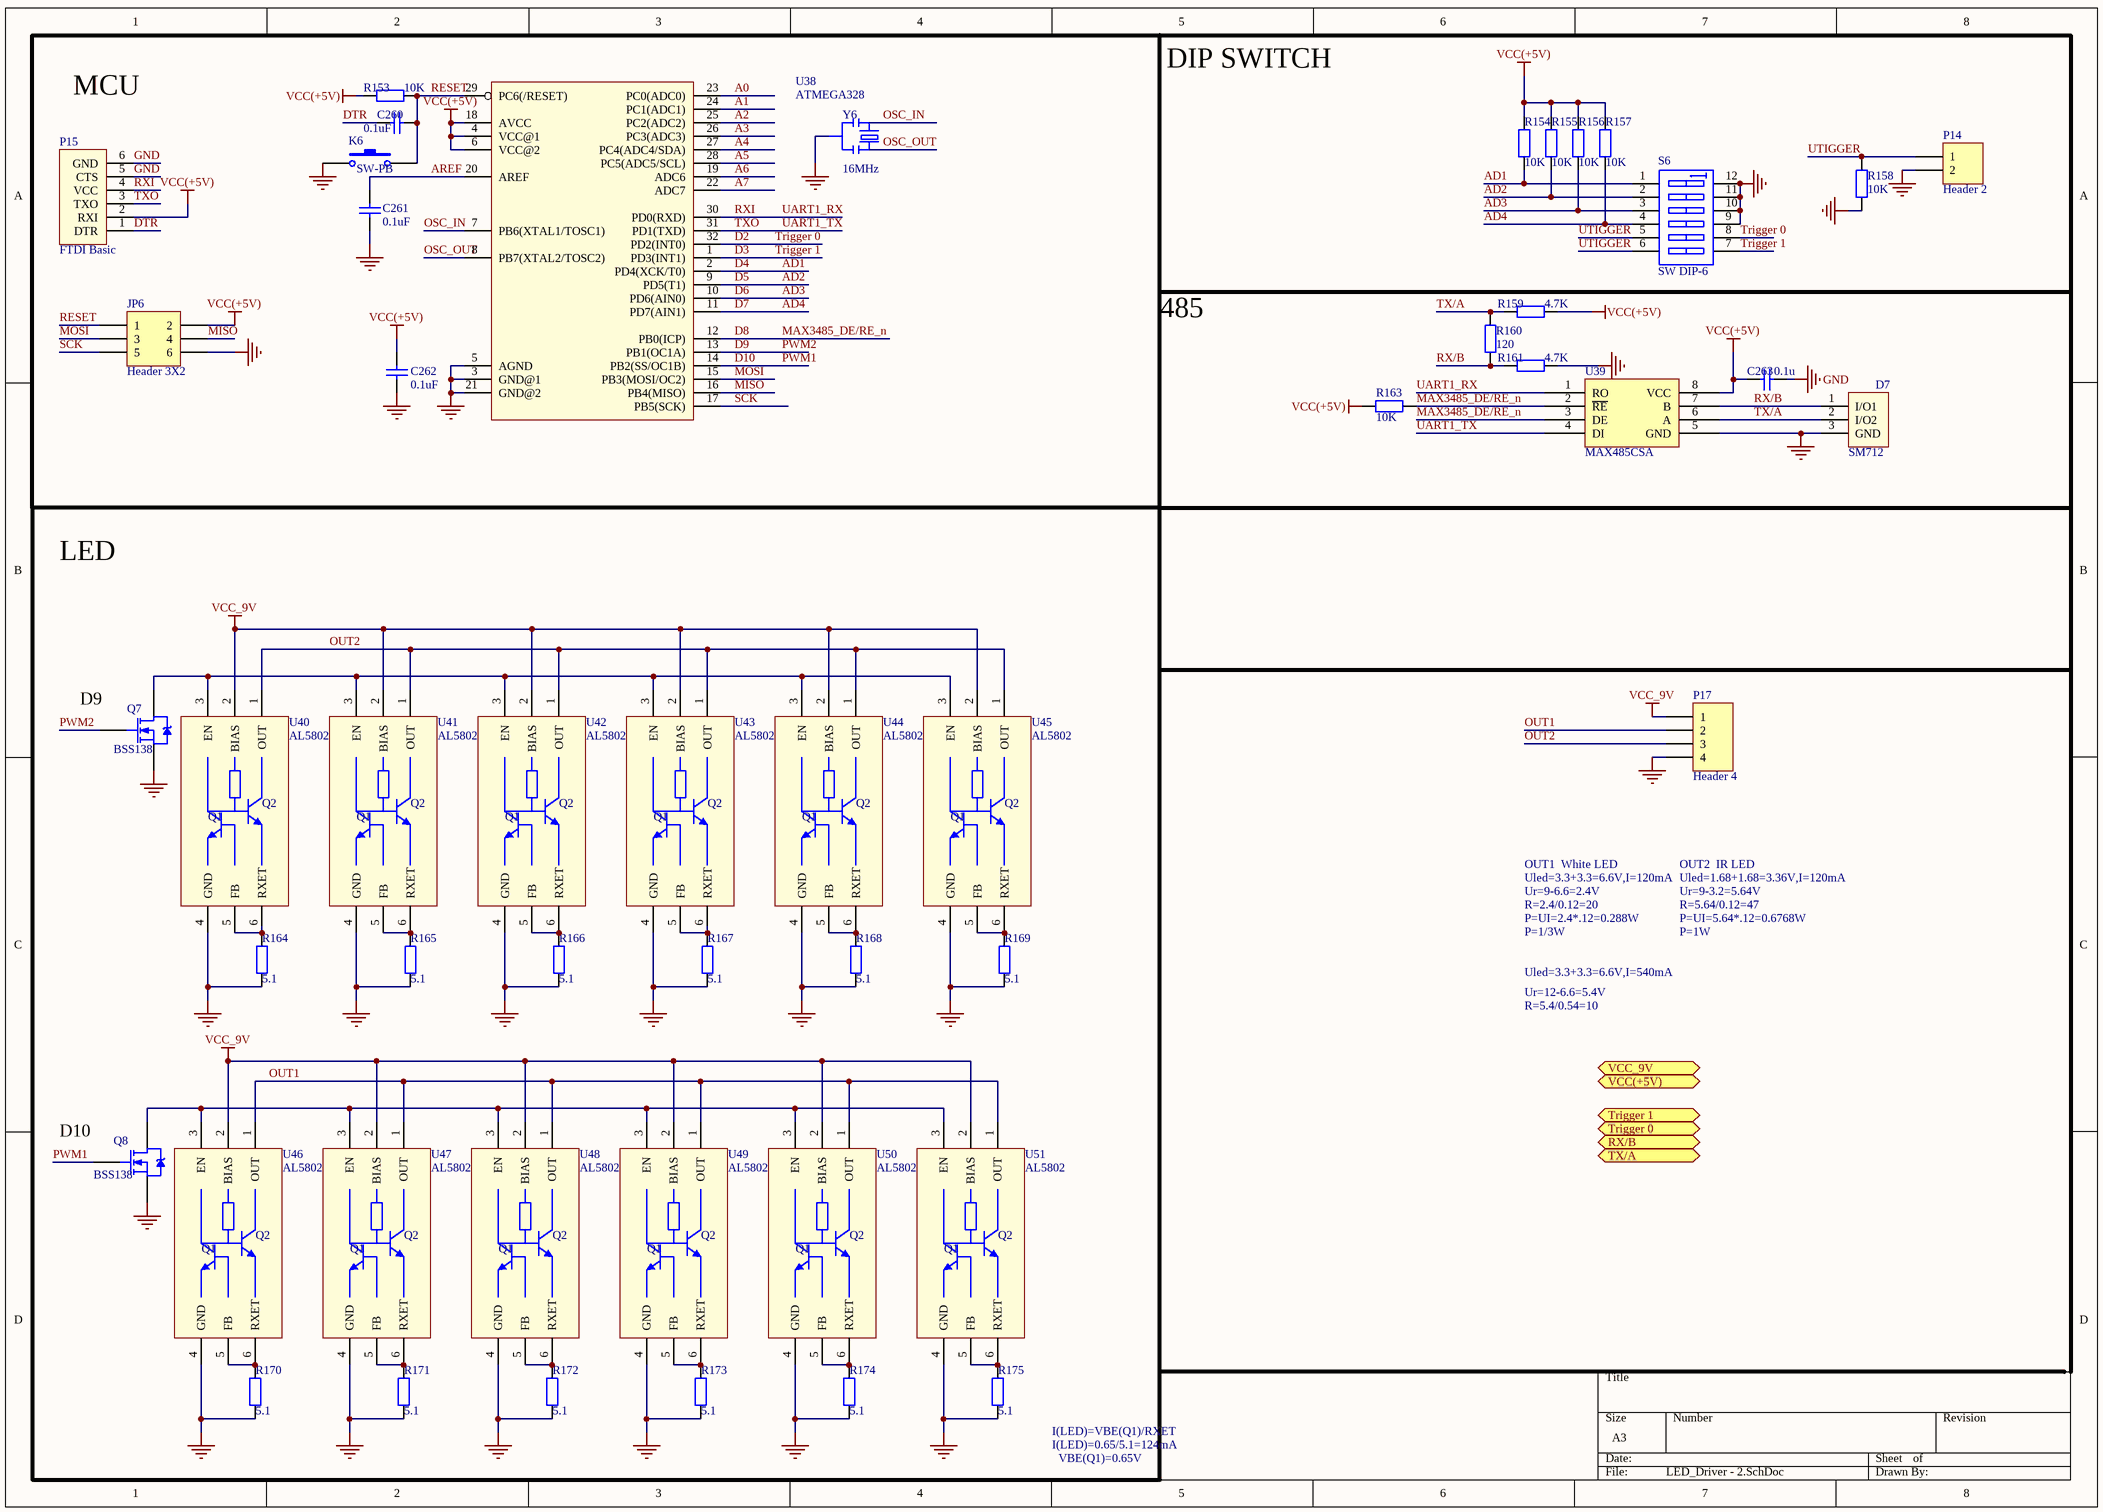
[diagram p8: LED_Driver - 2.SchDoc]

### Parts
C260  0.1uF  [C0603]
C261  0.1uF  [C0603]
C262  0.1uF  [C0603]
C263  0.1u  [C0603]
D7  SM712  [SOT23-3]
JP6  Header 3X2  [MHDR1X6]
K6  SW-PB  [157SW]
P14  Header 2  [HDR1X2]
P15  FTDI Basic  [MHDR1X6]
P17  Header 4  [SMT_1.25MM*4]
Q7  BSS138  [SOT-23 (Standard)]
Q8  BSS138  [SOT-23 (Standard)]
R153  10K  [R0603]
R154  10K  [R0603]
R155  10K  [R0603]
R156  10K  [R0603]
R157  10K  [R0603]
R158  10K  [R0603]
R159  4.7K  [R0603]
R160  120  [R0603]
R161  4.7K  [R0603]
R163  10K  [R0603]
R164  5.1  [R0603]
R165  5.1  [R0603]
R166  5.1  [R0603]
R167  5.1  [R0603]
R168  5.1  [R0603]
R169  5.1  [R0603]
R170  5.1  [R0603]
R171  5.1  [R0603]
R172  5.1  [R0603]
R173  5.1  [R0603]
R174  5.1  [R0603]
R175  5.1  [R0603]
S6  SW DIP-6  [DIP_SW_6WAY_SMD]
U38  ATMEGA328  [TQFP32-08]
U39  MAX485CSA  [SOIC-8]
U40  AL5802  [SOT26]
U41  AL5802  [SOT26]
U42  AL5802  [SOT26]
U43  AL5802  [SOT26]
U44  AL5802  [SOT26]
U45  AL5802  [SOT26]
U46  AL5802  [SOT26]
U47  AL5802  [SOT26]
U48  AL5802  [SOT26]
U49  AL5802  [SOT26]
U50  AL5802  [SOT26]
U51  AL5802  [SOT26]
Y6  16MHz  [RESONATOR-SMD]

### Blocks framed on the sheet
LED: Q7 Q8 R164-R175 U40-U51

### Ports
RX/B (bidir), Trigger 0 (bidir), Trigger 1 (bidir), TX/A (bidir), VCC(+5V) (in), VCC_9V (bidir)

### Nets
GND: C261.1 C262.2 C263.1 D7.3(GND) JP6.6 K6.1 P14.2 P15.5(CTS) P15.6(GND) P17.4 Q7.S Q8.S R158.1 R161.1 R164.2 R165.2 R166.2 R167.2 R168.2 R169.2 R170.2 R171.2 R172.2 R173.2 R174.2 R175.2 S6.9(B4) S6.10(B3) S6.11(B2) S6.12(B1) U38.3(GND@1) U38.5(AGND) U38.21(GND@2) U39.5(GND) U40.4(GND) U41.4(GND) U42.4(GND) U43.4(GND) U44.4(GND) U45.4(GND) U46.4(GND) U47.4(GND) U48.4(GND) U49.4(GND) U50.4(GND) U51.4(GND) Y6.2
VCC(+5V): C262.1 C263.2 JP6.2 P15.2(RXI) R153.1 R154.1 R155.1 R156.1 R157.1 R159.1 R163.2 U38.4(VCC@1) U38.6(VCC@2) U38.18(AVCC) U39.8(VCC)
VCC_9V: P17.1 U40.2(BIAS) U41.2(BIAS) U42.2(BIAS) U43.2(BIAS) U44.2(BIAS) U45.2(BIAS) U46.2(BIAS) U47.2(BIAS) U48.2(BIAS) U49.2(BIAS) U50.2(BIAS) U51.2(BIAS)
A0: U38.23(PC0(ADC0))
A1: U38.24(PC1(ADC1))
A2: U38.25(PC2(ADC2))
A3: U38.26(PC3(ADC3))
A4: U38.27(PC4(ADC4/SDA))
A5: U38.28(PC5(ADC5/SCL))
A6: U38.19(ADC6)
A7: U38.22(ADC7)
AD1: R154.2 S6.1(A1) U38.2(PD4(XCK/T0))  [also labelled D4]
AD2: R155.2 S6.2(A2) U38.9(PD5(T1))  [also labelled D5]
AD3: R156.2 S6.3(A3) U38.10(PD6(AIN0))  [also labelled D6]
AD4: R157.2 S6.4(A4) U38.11(PD7(AIN1))  [also labelled D7]
AREF: C261.2 U38.20(AREF)
D2: S6.8(B5) U38.32(PD2(INT0))  [also labelled Trigger 0]
D3: S6.7(B6) U38.1(PD3(INT1))  [also labelled Trigger 1]
D8: R163.1 U38.12(PB0(ICP)) U39.2(~{RE}) U39.3(DE)  [also labelled MAX3485_DE/RE_n]
D9: Q7.G U38.13(PB1(OC1A))  [also labelled PWM2]
D10: Q8.G U38.14(PB2(SS/OC1B))  [also labelled PWM1]
DTR: C260.1 P15.1(DTR)
MISO: JP6.4 U38.16(PB4(MISO))
MOSI: JP6.3 U38.15(PB3(MOSI/OC2))
OSC_IN: U38.7(PB6(XTAL1/TOSC1)) Y6.3
OSC_OUT: U38.8(PB7(XTAL2/TOSC2)) Y6.1
OUT1: P17.2 U46.1(OUT) U47.1(OUT) U48.1(OUT) U49.1(OUT) U50.1(OUT) U51.1(OUT)
OUT2: P17.3 U40.1(OUT) U41.1(OUT) U42.1(OUT) U43.1(OUT) U44.1(OUT) U45.1(OUT)
RESET: C260.2 JP6.1 K6.2 R153.2 U38.29(PC6(/RESET))
RX/B: D7.1(I/O1) R160.2 R161.2 U39.7(B)
RXI: P15.4(VCC) U38.30(PD0(RXD)) U39.1(RO)  [also labelled UART1_RX]
SCK: JP6.5 U38.17(PB5(SCK))
TX/A: D7.2(I/O2) R159.2 R160.1 U39.6(A)
TXO: P15.3(TXO) U38.31(PD1(TXD)) U39.4(DI)  [also labelled UART1_TX]
UTIGGER: P14.1 R158.2 S6.5(A5) S6.6(A6)
NetQ7_D: Q7.D U40.3(EN) U41.3(EN) U42.3(EN) U43.3(EN) U44.3(EN) U45.3(EN)
NetQ8_D: Q8.D U46.3(EN) U47.3(EN) U48.3(EN) U49.3(EN) U50.3(EN) U51.3(EN)
NetR164_1: R164.1 U40.5(FB) U40.6(RXET)
NetR165_1: R165.1 U41.5(FB) U41.6(RXET)
NetR166_1: R166.1 U42.5(FB) U42.6(RXET)
NetR167_1: R167.1 U43.5(FB) U43.6(RXET)
NetR168_1: R168.1 U44.5(FB) U44.6(RXET)
NetR169_1: R169.1 U45.5(FB) U45.6(RXET)
NetR170_1: R170.1 U46.5(FB) U46.6(RXET)
NetR171_1: R171.1 U47.5(FB) U47.6(RXET)
NetR172_1: R172.1 U48.5(FB) U48.6(RXET)
NetR173_1: R173.1 U49.5(FB) U49.6(RXET)
NetR174_1: R174.1 U50.5(FB) U50.6(RXET)
NetR175_1: R175.1 U51.5(FB) U51.6(RXET)

### Notes on the sheet
- MCU
- DIP SWITCH
- 485
- (near Q7) D9
- Uled=3.3+3.3=6.6V,I=120mA
- OUT1  White LED
- R=2.4/0.12=20
- P=UI=2.4*.12=0.288W
- Ur=9-6.6=2.4V
- Uled=1.68+1.68=3.36V,I=120mA
- OUT2  IR LED
- R=5.64/0.12=47
- P=UI=5.64*.12=0.6768W
- Ur=9-3.2=5.64V
- P=1/3W
- Uled=3.3+3.3=6.6V,I=540mA
- Ur=12-6.6=5.4V
- P=1W
- R=5.4/0.54=10
- (near Q8) D10
- I(LED)=VBE(Q1)/RXET
- I(LED)=0.65/5.1=124mA
- VBE(Q1)=0.65V
- (in symbol AL5802) Q2; Q1

### Library data of the parts
C260-C262 = CAP SMT C100nF25V10%X7R: Capacitor; Voltage: 25V; iPartNumber: C100nF25V10%X7R; Value: 0.1uF
C263 = Cap: Capacitor; Value: 100pF; Published: 8-Jun-2000; LatestRevisionDate: 17-Jul-2002; LatestRevisionNote: Re-released for DXP Platform.; PackageReference: RAD-0.3; Publisher: Altium Limited
JP6 = Header 3X2: Header, 3-Pin, Dual row; LatestRevisionDate: 17-Jul-2002; LatestRevisionNote: Re-released for DXP Platform.; Publisher: Altium Limited
K6 = SW-PB: Switch; Published: 24-Mar-1999; LatestRevisionDate: 17-Jul-2002; LatestRevisionNote: Re-released for DXP Platform.; PackageReference: SPST-2; Publisher: Altium Limited; PackageDescription: Switch; 2 Leads
P14 = Header 2: Header, 2-Pin; LatestRevisionDate: 17-Jul-2002; LatestRevisionNote: Re-released for DXP Platform.; Publisher: Altium Limited
P15 = ARDUINO_SERIAL_PROGRAMPTH
P17 = Header 4: Header, 4-Pin; LatestRevisionDate: 17-Jul-2002; LatestRevisionNote: Re-released for DXP Platform.; Publisher: Altium Limited
Q7 Q8 = NMOS: as Q5 on sheet LED_Driver - 1; Supplier 1: Digi-Key; Supplier Part Number 1: BSS123NCT-ND; RoHS: RoHS Compliant; Category: Discrete Semiconductor Products; Stock 1: 163946; Pricing 1: 1=0.24, 10=0.216, 25=0.1556, 100=0.1211, 250=0.07612, 500=0.06484, 1000=0.04418 (USD); Packaging: Cut Tape (CT); Mounting Type: Surface Mount; Package / Case: TO-236-3, SC-59, SOT-23-3; Supplier Device Package: SOT-23; ComponentLink1URL: http://www.fairchildsemi.com/datasheets/BS/BSS123.pdf; ComponentLink1Description: http://www.fairchildsemi.com/datasheets/BS/BSS123.pdf
R153-R157 R159-R161 R163-R175 = Res2: Resistor
R158 = Res2: Resistor; Value: 1k; Published: 8-Jun-2000; LatestRevisionDate: 17-Jul-2002; LatestRevisionNote: Re-released for DXP Platform.; PackageReference: AXIAL-0.4; Publisher: Altium Limited
S6 = SW DIP-6: DIP Switch, 6 Position, SPST; Published: 24-Mar-1999; LatestRevisionDate: 17-Jul-2002; LatestRevisionNote: Re-released for DXP Platform.; PackageReference: DIP-12/SW; Publisher: Altium Limited
U38 = ATMEGA168
U39 = MAX3485CSA
Y6 = RESONATORSMD

## Sheet LED_Driver - 3.SchDoc
size A3
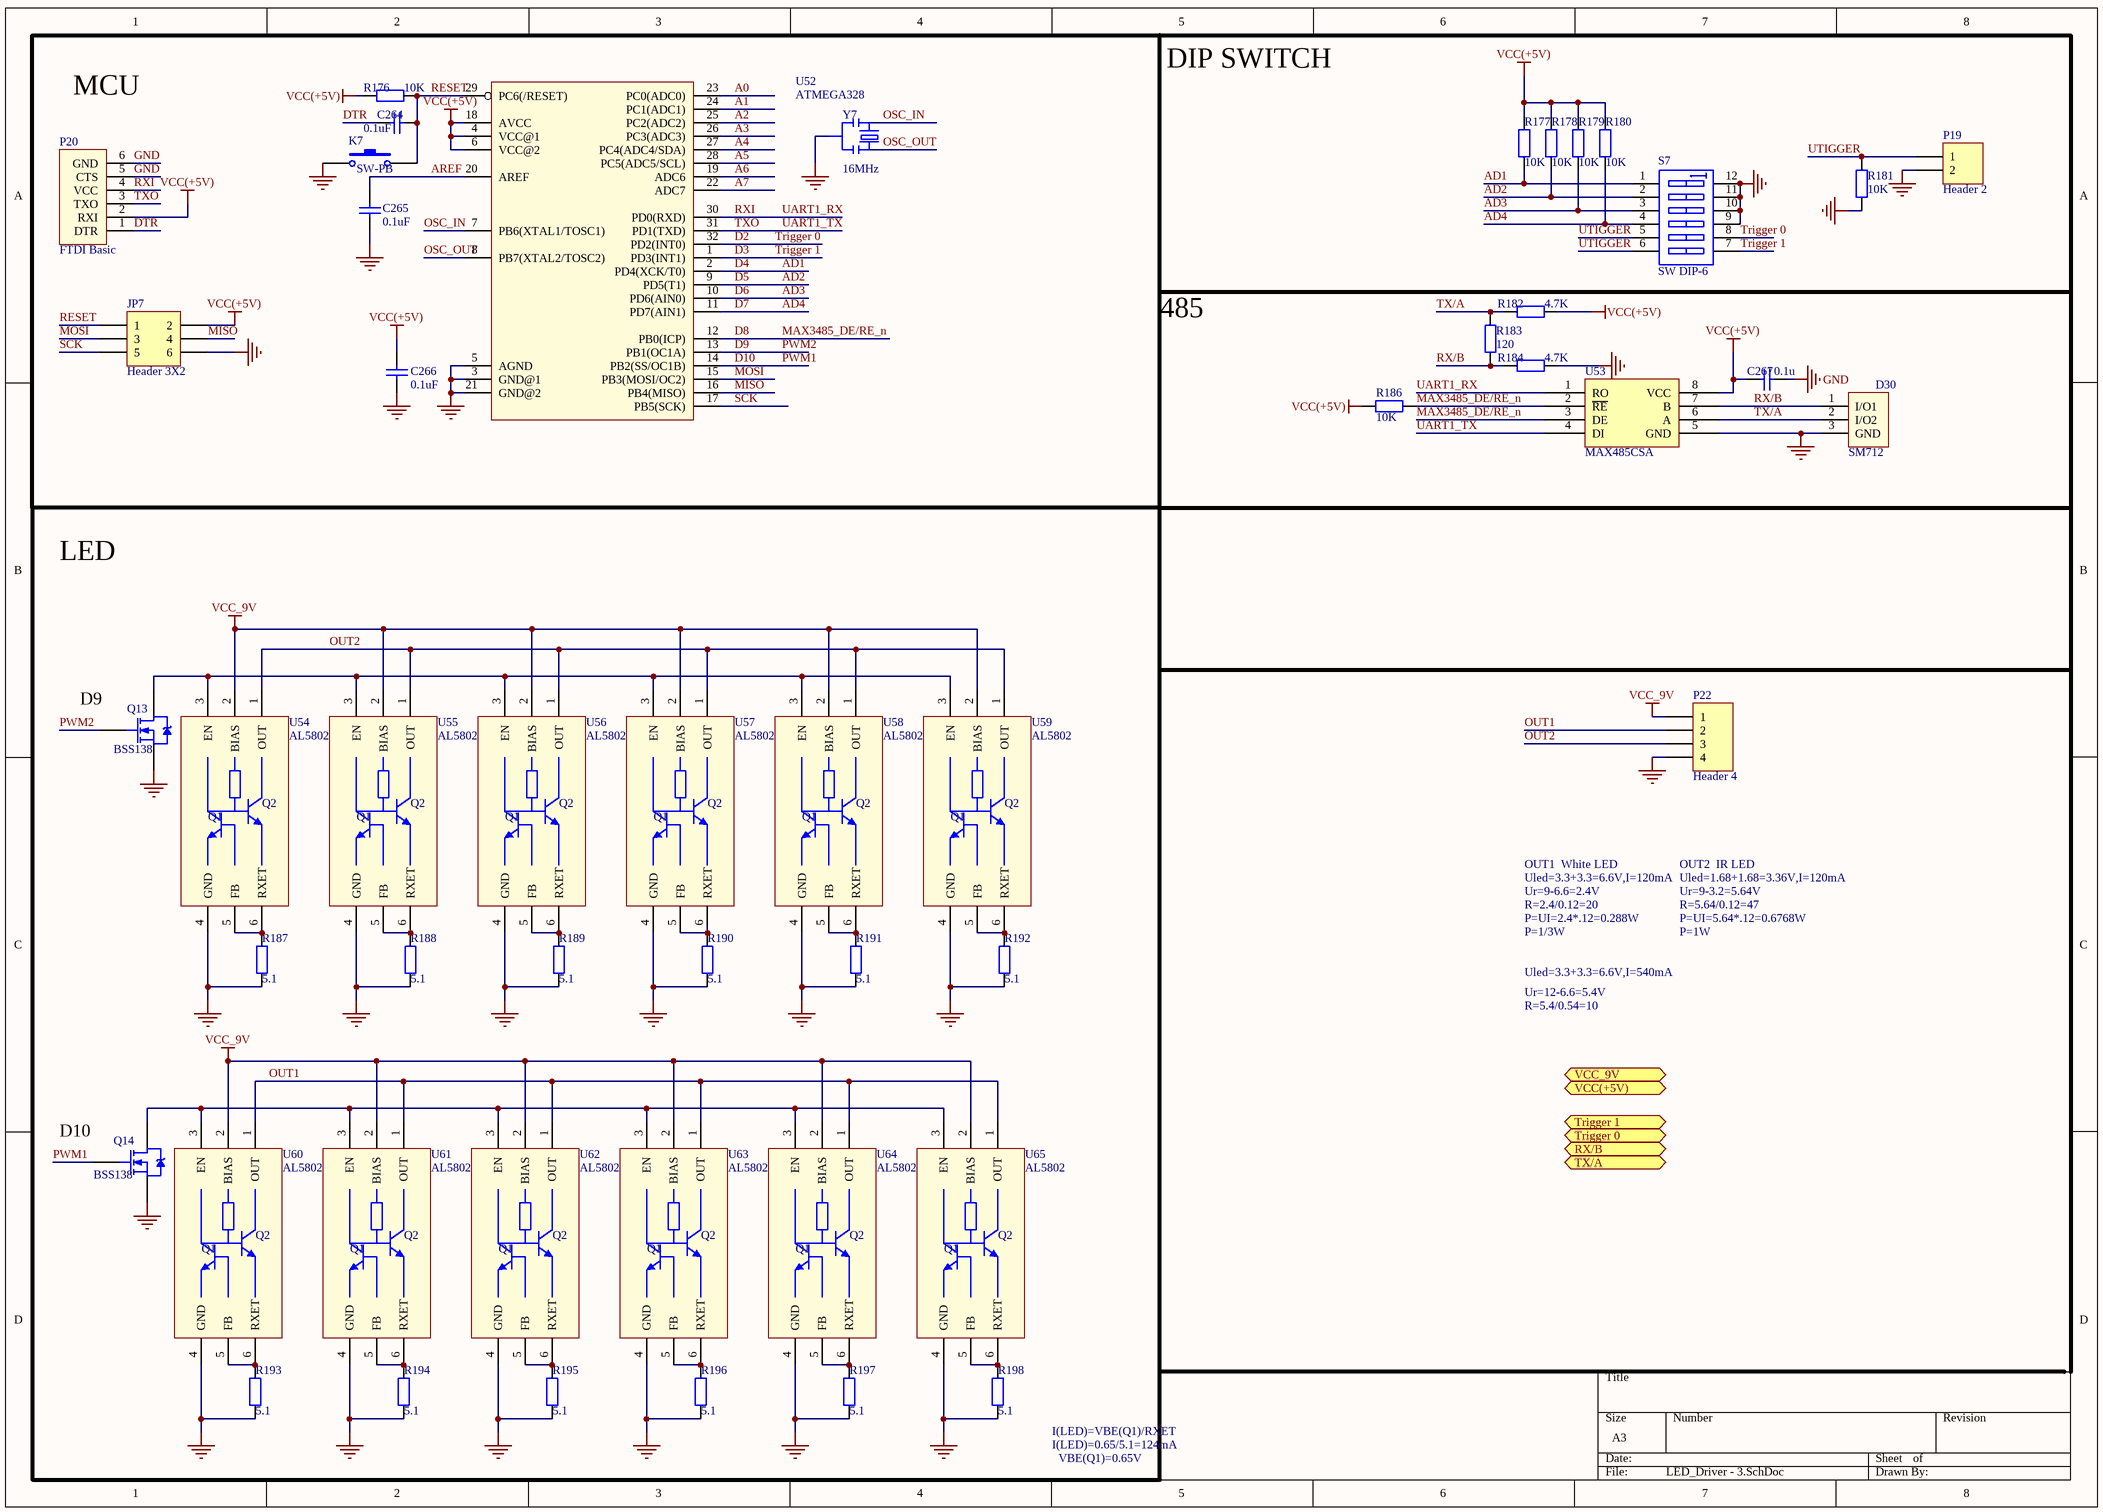
[diagram p9: LED_Driver - 3.SchDoc]

### Parts
C264  0.1uF  [C0603]
C265  0.1uF  [C0603]
C266  0.1uF  [C0603]
C267  0.1u  [C0603]
D30  SM712  [SOT23-3]
JP7  Header 3X2  [MHDR1X6]
K7  SW-PB  [157SW]
P19  Header 2  [HDR1X2]
P20  FTDI Basic  [MHDR1X6]
P22  Header 4  [SMT_1.25MM*4]
Q13  BSS138  [SOT-23 (Standard)]
Q14  BSS138  [SOT-23 (Standard)]
R176  10K  [R0603]
R177  10K  [R0603]
R178  10K  [R0603]
R179  10K  [R0603]
R180  10K  [R0603]
R181  10K  [R0603]
R182  4.7K  [R0603]
R183  120  [R0603]
R184  4.7K  [R0603]
R186  10K  [R0603]
R187  5.1  [R0603]
R188  5.1  [R0603]
R189  5.1  [R0603]
R190  5.1  [R0603]
R191  5.1  [R0603]
R192  5.1  [R0603]
R193  5.1  [R0603]
R194  5.1  [R0603]
R195  5.1  [R0603]
R196  5.1  [R0603]
R197  5.1  [R0603]
R198  5.1  [R0603]
S7  SW DIP-6  [DIP_SW_6WAY_SMD]
U52  ATMEGA328  [TQFP32-08]
U53  MAX485CSA  [SOIC-8]
U54  AL5802  [SOT26]
U55  AL5802  [SOT26]
U56  AL5802  [SOT26]
U57  AL5802  [SOT26]
U58  AL5802  [SOT26]
U59  AL5802  [SOT26]
U60  AL5802  [SOT26]
U61  AL5802  [SOT26]
U62  AL5802  [SOT26]
U63  AL5802  [SOT26]
U64  AL5802  [SOT26]
U65  AL5802  [SOT26]
Y7  16MHz  [RESONATOR-SMD]

### Blocks framed on the sheet
LED: Q13 Q14 R187-R198 U54-U65

### Ports
RX/B (bidir), Trigger 0 (bidir), Trigger 1 (bidir), TX/A (bidir), VCC(+5V) (in), VCC_9V (bidir)

### Nets
GND: C265.1 C266.2 C267.1 D30.3(GND) JP7.6 K7.1 P19.2 P20.5(CTS) P20.6(GND) P22.4 Q13.S Q14.S R181.1 R184.1 R187.2 R188.2 R189.2 R190.2 R191.2 R192.2 R193.2 R194.2 R195.2 R196.2 R197.2 R198.2 S7.9(B4) S7.10(B3) S7.11(B2) S7.12(B1) U52.3(GND@1) U52.5(AGND) U52.21(GND@2) U53.5(GND) U54.4(GND) U55.4(GND) U56.4(GND) U57.4(GND) U58.4(GND) U59.4(GND) U60.4(GND) U61.4(GND) U62.4(GND) U63.4(GND) U64.4(GND) U65.4(GND) Y7.2
VCC(+5V): C266.1 C267.2 JP7.2 P20.2(RXI) R176.1 R177.1 R178.1 R179.1 R180.1 R182.1 R186.2 U52.4(VCC@1) U52.6(VCC@2) U52.18(AVCC) U53.8(VCC)
VCC_9V: P22.1 U54.2(BIAS) U55.2(BIAS) U56.2(BIAS) U57.2(BIAS) U58.2(BIAS) U59.2(BIAS) U60.2(BIAS) U61.2(BIAS) U62.2(BIAS) U63.2(BIAS) U64.2(BIAS) U65.2(BIAS)
A0: U52.23(PC0(ADC0))
A1: U52.24(PC1(ADC1))
A2: U52.25(PC2(ADC2))
A3: U52.26(PC3(ADC3))
A4: U52.27(PC4(ADC4/SDA))
A5: U52.28(PC5(ADC5/SCL))
A6: U52.19(ADC6)
A7: U52.22(ADC7)
AD1: R177.2 S7.1(A1) U52.2(PD4(XCK/T0))  [also labelled D4]
AD2: R178.2 S7.2(A2) U52.9(PD5(T1))  [also labelled D5]
AD3: R179.2 S7.3(A3) U52.10(PD6(AIN0))  [also labelled D6]
AD4: R180.2 S7.4(A4) U52.11(PD7(AIN1))  [also labelled D7]
AREF: C265.2 U52.20(AREF)
D2: S7.8(B5) U52.32(PD2(INT0))  [also labelled Trigger 0]
D3: S7.7(B6) U52.1(PD3(INT1))  [also labelled Trigger 1]
D8: R186.1 U52.12(PB0(ICP)) U53.2(~{RE}) U53.3(DE)  [also labelled MAX3485_DE/RE_n]
D9: Q13.G U52.13(PB1(OC1A))  [also labelled PWM2]
D10: Q14.G U52.14(PB2(SS/OC1B))  [also labelled PWM1]
DTR: C264.1 P20.1(DTR)
MISO: JP7.4 U52.16(PB4(MISO))
MOSI: JP7.3 U52.15(PB3(MOSI/OC2))
OSC_IN: U52.7(PB6(XTAL1/TOSC1)) Y7.3
OSC_OUT: U52.8(PB7(XTAL2/TOSC2)) Y7.1
OUT1: P22.2 U60.1(OUT) U61.1(OUT) U62.1(OUT) U63.1(OUT) U64.1(OUT) U65.1(OUT)
OUT2: P22.3 U54.1(OUT) U55.1(OUT) U56.1(OUT) U57.1(OUT) U58.1(OUT) U59.1(OUT)
RESET: C264.2 JP7.1 K7.2 R176.2 U52.29(PC6(/RESET))
RX/B: D30.1(I/O1) R183.2 R184.2 U53.7(B)
RXI: P20.4(VCC) U52.30(PD0(RXD)) U53.1(RO)  [also labelled UART1_RX]
SCK: JP7.5 U52.17(PB5(SCK))
TX/A: D30.2(I/O2) R182.2 R183.1 U53.6(A)
TXO: P20.3(TXO) U52.31(PD1(TXD)) U53.4(DI)  [also labelled UART1_TX]
UTIGGER: P19.1 R181.2 S7.5(A5) S7.6(A6)
NetQ13_D: Q13.D U54.3(EN) U55.3(EN) U56.3(EN) U57.3(EN) U58.3(EN) U59.3(EN)
NetQ14_D: Q14.D U60.3(EN) U61.3(EN) U62.3(EN) U63.3(EN) U64.3(EN) U65.3(EN)
NetR187_1: R187.1 U54.5(FB) U54.6(RXET)
NetR188_1: R188.1 U55.5(FB) U55.6(RXET)
NetR189_1: R189.1 U56.5(FB) U56.6(RXET)
NetR190_1: R190.1 U57.5(FB) U57.6(RXET)
NetR191_1: R191.1 U58.5(FB) U58.6(RXET)
NetR192_1: R192.1 U59.5(FB) U59.6(RXET)
NetR193_1: R193.1 U60.5(FB) U60.6(RXET)
NetR194_1: R194.1 U61.5(FB) U61.6(RXET)
NetR195_1: R195.1 U62.5(FB) U62.6(RXET)
NetR196_1: R196.1 U63.5(FB) U63.6(RXET)
NetR197_1: R197.1 U64.5(FB) U64.6(RXET)
NetR198_1: R198.1 U65.5(FB) U65.6(RXET)

### Notes on the sheet
- MCU
- DIP SWITCH
- 485
- (near Q13) D9
- Uled=3.3+3.3=6.6V,I=120mA
- OUT1  White LED
- R=2.4/0.12=20
- P=UI=2.4*.12=0.288W
- Ur=9-6.6=2.4V
- Uled=1.68+1.68=3.36V,I=120mA
- OUT2  IR LED
- R=5.64/0.12=47
- P=UI=5.64*.12=0.6768W
- Ur=9-3.2=5.64V
- P=1/3W
- Uled=3.3+3.3=6.6V,I=540mA
- Ur=12-6.6=5.4V
- P=1W
- R=5.4/0.54=10
- (near Q14) D10
- I(LED)=VBE(Q1)/RXET
- I(LED)=0.65/5.1=124mA
- VBE(Q1)=0.65V
- (in symbol AL5802) Q2; Q1

### Library data of the parts
C264-C266 = CAP SMT C100nF25V10%X7R: Capacitor; Voltage: 25V; iPartNumber: C100nF25V10%X7R; Value: 0.1uF
C267 = Cap: Capacitor; Value: 100pF; Published: 8-Jun-2000; LatestRevisionDate: 17-Jul-2002; LatestRevisionNote: Re-released for DXP Platform.; PackageReference: RAD-0.3; Publisher: Altium Limited
JP7 = Header 3X2: Header, 3-Pin, Dual row; LatestRevisionDate: 17-Jul-2002; LatestRevisionNote: Re-released for DXP Platform.; Publisher: Altium Limited
K7 = SW-PB: Switch; Published: 24-Mar-1999; LatestRevisionDate: 17-Jul-2002; LatestRevisionNote: Re-released for DXP Platform.; PackageReference: SPST-2; Publisher: Altium Limited; PackageDescription: Switch; 2 Leads
P19 = Header 2: Header, 2-Pin; LatestRevisionDate: 17-Jul-2002; LatestRevisionNote: Re-released for DXP Platform.; Publisher: Altium Limited
P20 = ARDUINO_SERIAL_PROGRAMPTH
P22 = Header 4: Header, 4-Pin; LatestRevisionDate: 17-Jul-2002; LatestRevisionNote: Re-released for DXP Platform.; Publisher: Altium Limited
Q13 Q14 = NMOS: as Q5 on sheet LED_Driver - 1; Supplier 1: Digi-Key; Supplier Part Number 1: BSS123NCT-ND; RoHS: RoHS Compliant; Category: Discrete Semiconductor Products; Stock 1: 163946; Pricing 1: 1=0.24, 10=0.216, 25=0.1556, 100=0.1211, 250=0.07612, 500=0.06484, 1000=0.04418 (USD); Packaging: Cut Tape (CT); Mounting Type: Surface Mount; Package / Case: TO-236-3, SC-59, SOT-23-3; Supplier Device Package: SOT-23; ComponentLink1URL: http://www.fairchildsemi.com/datasheets/BS/BSS123.pdf; ComponentLink1Description: http://www.fairchildsemi.com/datasheets/BS/BSS123.pdf
R176-R180 R182-R184 R186-R198 = Res2: Resistor
R181 = Res2: Resistor; Value: 1k; Published: 8-Jun-2000; LatestRevisionDate: 17-Jul-2002; LatestRevisionNote: Re-released for DXP Platform.; PackageReference: AXIAL-0.4; Publisher: Altium Limited
S7 = SW DIP-6: DIP Switch, 6 Position, SPST; Published: 24-Mar-1999; LatestRevisionDate: 17-Jul-2002; LatestRevisionNote: Re-released for DXP Platform.; PackageReference: DIP-12/SW; Publisher: Altium Limited
U52 = ATMEGA168
U53 = MAX3485CSA
Y7 = RESONATORSMD

## Sheet LED_Driver - 4.SchDoc
size A3
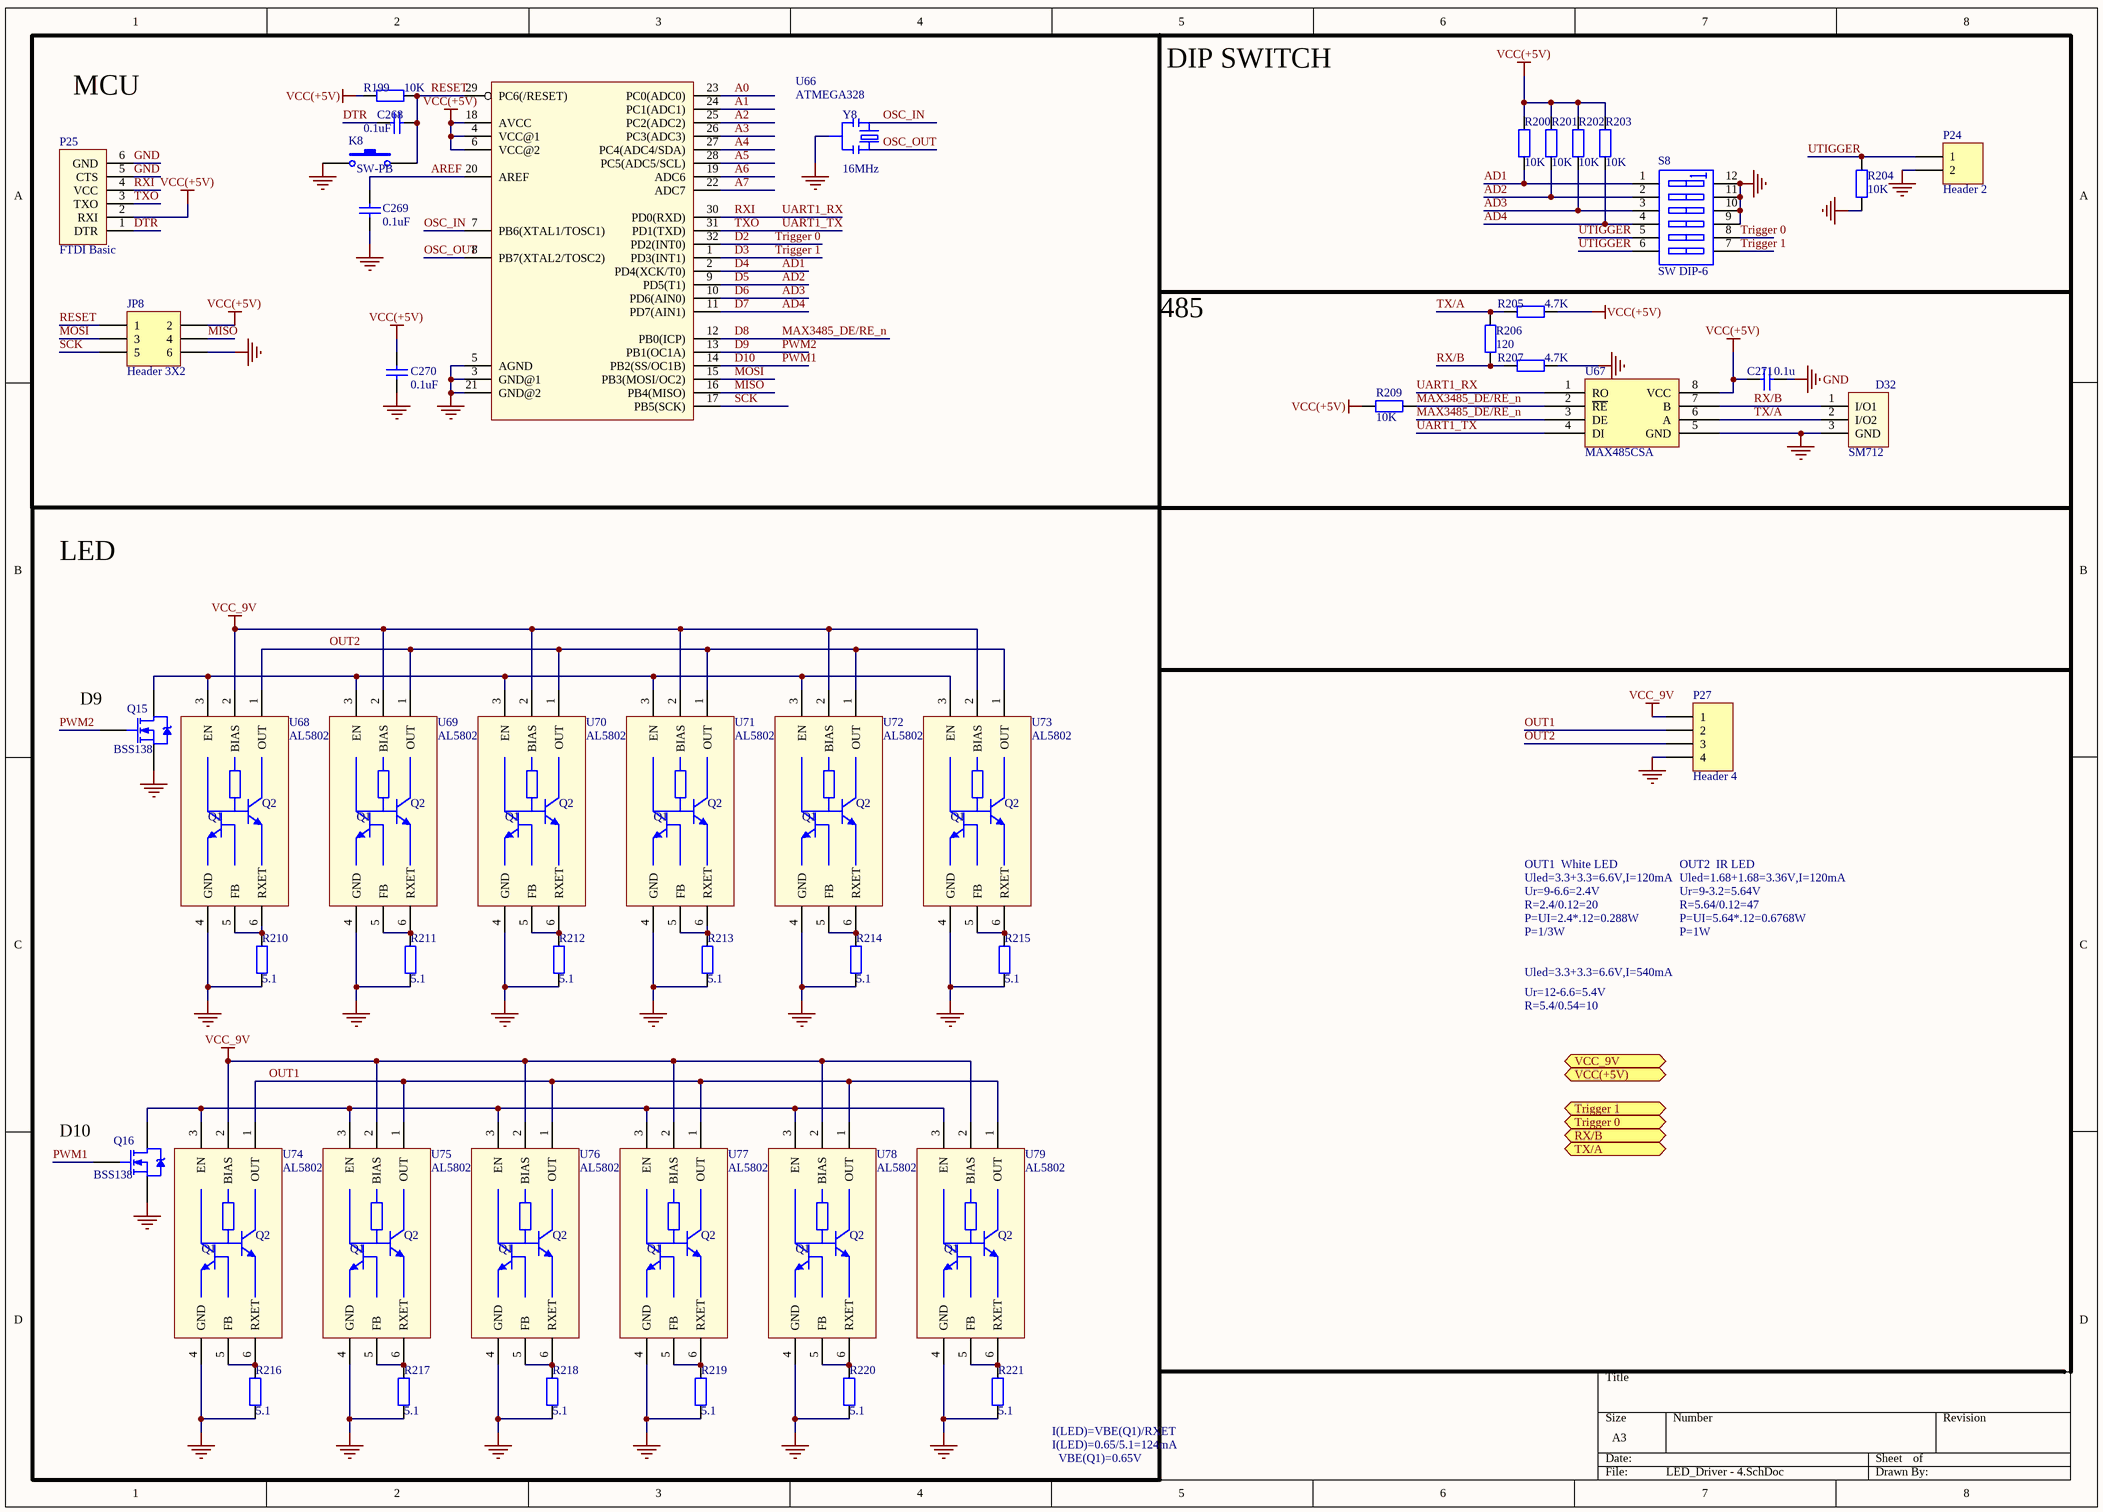
[diagram p10: LED_Driver - 4.SchDoc]

### Parts
C268  0.1uF  [C0603]
C269  0.1uF  [C0603]
C270  0.1uF  [C0603]
C271  0.1u  [C0603]
D32  SM712  [SOT23-3]
JP8  Header 3X2  [MHDR1X6]
K8  SW-PB  [157SW]
P24  Header 2  [HDR1X2]
P25  FTDI Basic  [MHDR1X6]
P27  Header 4  [SMT_1.25MM*4]
Q15  BSS138  [SOT-23 (Standard)]
Q16  BSS138  [SOT-23 (Standard)]
R199  10K  [R0603]
R200  10K  [R0603]
R201  10K  [R0603]
R202  10K  [R0603]
R203  10K  [R0603]
R204  10K  [R0603]
R205  4.7K  [R0603]
R206  120  [R0603]
R207  4.7K  [R0603]
R209  10K  [R0603]
R210  5.1  [R0603]
R211  5.1  [R0603]
R212  5.1  [R0603]
R213  5.1  [R0603]
R214  5.1  [R0603]
R215  5.1  [R0603]
R216  5.1  [R0603]
R217  5.1  [R0603]
R218  5.1  [R0603]
R219  5.1  [R0603]
R220  5.1  [R0603]
R221  5.1  [R0603]
S8  SW DIP-6  [DIP_SW_6WAY_SMD]
U66  ATMEGA328  [TQFP32-08]
U67  MAX485CSA  [SOIC-8]
U68  AL5802  [SOT26]
U69  AL5802  [SOT26]
U70  AL5802  [SOT26]
U71  AL5802  [SOT26]
U72  AL5802  [SOT26]
U73  AL5802  [SOT26]
U74  AL5802  [SOT26]
U75  AL5802  [SOT26]
U76  AL5802  [SOT26]
U77  AL5802  [SOT26]
U78  AL5802  [SOT26]
U79  AL5802  [SOT26]
Y8  16MHz  [RESONATOR-SMD]

### Blocks framed on the sheet
LED: Q15 Q16 R210-R221 U68-U79

### Ports
RX/B (bidir), Trigger 0 (bidir), Trigger 1 (bidir), TX/A (bidir), VCC(+5V) (in), VCC_9V (bidir)

### Nets
GND: C269.1 C270.2 C271.1 D32.3(GND) JP8.6 K8.1 P24.2 P25.5(CTS) P25.6(GND) P27.4 Q15.S Q16.S R204.1 R207.1 R210.2 R211.2 R212.2 R213.2 R214.2 R215.2 R216.2 R217.2 R218.2 R219.2 R220.2 R221.2 S8.9(B4) S8.10(B3) S8.11(B2) S8.12(B1) U66.3(GND@1) U66.5(AGND) U66.21(GND@2) U67.5(GND) U68.4(GND) U69.4(GND) U70.4(GND) U71.4(GND) U72.4(GND) U73.4(GND) U74.4(GND) U75.4(GND) U76.4(GND) U77.4(GND) U78.4(GND) U79.4(GND) Y8.2
VCC(+5V): C270.1 C271.2 JP8.2 P25.2(RXI) R199.1 R200.1 R201.1 R202.1 R203.1 R205.1 R209.2 U66.4(VCC@1) U66.6(VCC@2) U66.18(AVCC) U67.8(VCC)
VCC_9V: P27.1 U68.2(BIAS) U69.2(BIAS) U70.2(BIAS) U71.2(BIAS) U72.2(BIAS) U73.2(BIAS) U74.2(BIAS) U75.2(BIAS) U76.2(BIAS) U77.2(BIAS) U78.2(BIAS) U79.2(BIAS)
A0: U66.23(PC0(ADC0))
A1: U66.24(PC1(ADC1))
A2: U66.25(PC2(ADC2))
A3: U66.26(PC3(ADC3))
A4: U66.27(PC4(ADC4/SDA))
A5: U66.28(PC5(ADC5/SCL))
A6: U66.19(ADC6)
A7: U66.22(ADC7)
AD1: R200.2 S8.1(A1) U66.2(PD4(XCK/T0))  [also labelled D4]
AD2: R201.2 S8.2(A2) U66.9(PD5(T1))  [also labelled D5]
AD3: R202.2 S8.3(A3) U66.10(PD6(AIN0))  [also labelled D6]
AD4: R203.2 S8.4(A4) U66.11(PD7(AIN1))  [also labelled D7]
AREF: C269.2 U66.20(AREF)
D2: S8.8(B5) U66.32(PD2(INT0))  [also labelled Trigger 0]
D3: S8.7(B6) U66.1(PD3(INT1))  [also labelled Trigger 1]
D8: R209.1 U66.12(PB0(ICP)) U67.2(~{RE}) U67.3(DE)  [also labelled MAX3485_DE/RE_n]
D9: Q15.G U66.13(PB1(OC1A))  [also labelled PWM2]
D10: Q16.G U66.14(PB2(SS/OC1B))  [also labelled PWM1]
DTR: C268.1 P25.1(DTR)
MISO: JP8.4 U66.16(PB4(MISO))
MOSI: JP8.3 U66.15(PB3(MOSI/OC2))
OSC_IN: U66.7(PB6(XTAL1/TOSC1)) Y8.3
OSC_OUT: U66.8(PB7(XTAL2/TOSC2)) Y8.1
OUT1: P27.2 U74.1(OUT) U75.1(OUT) U76.1(OUT) U77.1(OUT) U78.1(OUT) U79.1(OUT)
OUT2: P27.3 U68.1(OUT) U69.1(OUT) U70.1(OUT) U71.1(OUT) U72.1(OUT) U73.1(OUT)
RESET: C268.2 JP8.1 K8.2 R199.2 U66.29(PC6(/RESET))
RX/B: D32.1(I/O1) R206.2 R207.2 U67.7(B)
RXI: P25.4(VCC) U66.30(PD0(RXD)) U67.1(RO)  [also labelled UART1_RX]
SCK: JP8.5 U66.17(PB5(SCK))
TX/A: D32.2(I/O2) R205.2 R206.1 U67.6(A)
TXO: P25.3(TXO) U66.31(PD1(TXD)) U67.4(DI)  [also labelled UART1_TX]
UTIGGER: P24.1 R204.2 S8.5(A5) S8.6(A6)
NetQ15_D: Q15.D U68.3(EN) U69.3(EN) U70.3(EN) U71.3(EN) U72.3(EN) U73.3(EN)
NetQ16_D: Q16.D U74.3(EN) U75.3(EN) U76.3(EN) U77.3(EN) U78.3(EN) U79.3(EN)
NetR210_1: R210.1 U68.5(FB) U68.6(RXET)
NetR211_1: R211.1 U69.5(FB) U69.6(RXET)
NetR212_1: R212.1 U70.5(FB) U70.6(RXET)
NetR213_1: R213.1 U71.5(FB) U71.6(RXET)
NetR214_1: R214.1 U72.5(FB) U72.6(RXET)
NetR215_1: R215.1 U73.5(FB) U73.6(RXET)
NetR216_1: R216.1 U74.5(FB) U74.6(RXET)
NetR217_1: R217.1 U75.5(FB) U75.6(RXET)
NetR218_1: R218.1 U76.5(FB) U76.6(RXET)
NetR219_1: R219.1 U77.5(FB) U77.6(RXET)
NetR220_1: R220.1 U78.5(FB) U78.6(RXET)
NetR221_1: R221.1 U79.5(FB) U79.6(RXET)

### Notes on the sheet
- MCU
- DIP SWITCH
- 485
- (near Q15) D9
- Uled=3.3+3.3=6.6V,I=120mA
- OUT1  White LED
- R=2.4/0.12=20
- P=UI=2.4*.12=0.288W
- Ur=9-6.6=2.4V
- Uled=1.68+1.68=3.36V,I=120mA
- OUT2  IR LED
- R=5.64/0.12=47
- P=UI=5.64*.12=0.6768W
- Ur=9-3.2=5.64V
- P=1/3W
- Uled=3.3+3.3=6.6V,I=540mA
- Ur=12-6.6=5.4V
- P=1W
- R=5.4/0.54=10
- (near Q16) D10
- I(LED)=VBE(Q1)/RXET
- I(LED)=0.65/5.1=124mA
- VBE(Q1)=0.65V
- (in symbol AL5802) Q2; Q1

### Library data of the parts
C268-C270 = CAP SMT C100nF25V10%X7R: Capacitor; Voltage: 25V; iPartNumber: C100nF25V10%X7R; Value: 0.1uF
C271 = Cap: Capacitor; Value: 100pF; Published: 8-Jun-2000; LatestRevisionDate: 17-Jul-2002; LatestRevisionNote: Re-released for DXP Platform.; PackageReference: RAD-0.3; Publisher: Altium Limited
JP8 = Header 3X2: Header, 3-Pin, Dual row; LatestRevisionDate: 17-Jul-2002; LatestRevisionNote: Re-released for DXP Platform.; Publisher: Altium Limited
K8 = SW-PB: Switch; Published: 24-Mar-1999; LatestRevisionDate: 17-Jul-2002; LatestRevisionNote: Re-released for DXP Platform.; PackageReference: SPST-2; Publisher: Altium Limited; PackageDescription: Switch; 2 Leads
P24 = Header 2: Header, 2-Pin; LatestRevisionDate: 17-Jul-2002; LatestRevisionNote: Re-released for DXP Platform.; Publisher: Altium Limited
P25 = ARDUINO_SERIAL_PROGRAMPTH
P27 = Header 4: Header, 4-Pin; LatestRevisionDate: 17-Jul-2002; LatestRevisionNote: Re-released for DXP Platform.; Publisher: Altium Limited
Q15 Q16 = NMOS: as Q5 on sheet LED_Driver - 1; Supplier 1: Digi-Key; Supplier Part Number 1: BSS123NCT-ND; RoHS: RoHS Compliant; Category: Discrete Semiconductor Products; Stock 1: 163946; Pricing 1: 1=0.24, 10=0.216, 25=0.1556, 100=0.1211, 250=0.07612, 500=0.06484, 1000=0.04418 (USD); Packaging: Cut Tape (CT); Mounting Type: Surface Mount; Package / Case: TO-236-3, SC-59, SOT-23-3; Supplier Device Package: SOT-23; ComponentLink1URL: http://www.fairchildsemi.com/datasheets/BS/BSS123.pdf; ComponentLink1Description: http://www.fairchildsemi.com/datasheets/BS/BSS123.pdf
R199-R203 R205-R207 R209-R221 = Res2: Resistor
R204 = Res2: Resistor; Value: 1k; Published: 8-Jun-2000; LatestRevisionDate: 17-Jul-2002; LatestRevisionNote: Re-released for DXP Platform.; PackageReference: AXIAL-0.4; Publisher: Altium Limited
S8 = SW DIP-6: DIP Switch, 6 Position, SPST; Published: 24-Mar-1999; LatestRevisionDate: 17-Jul-2002; LatestRevisionNote: Re-released for DXP Platform.; PackageReference: DIP-12/SW; Publisher: Altium Limited
U66 = ATMEGA168
U67 = MAX3485CSA
Y8 = RESONATORSMD

## Nets that join several sheets
AVDD: Cyusb3014 - 2 (C53.2 C54.1 L6.2 U4.A7), Cyusb3014 - 4 (C133.2 C134.1 L14.2 U10.A7)
DVDD12: Power (C255.1 L25.2 U23.4), Cyusb3014 - 2 (20 pins), Cyusb3014 - 4 (20 pins), Cyusb3314_Power (56 pins)
GND: Power (12 pins), Cyusb3014 - 2 (65 pins), Cyusb3014 - 4 (65 pins), Cyusb3314_Indicator (46 pins), Cyusb3314_Interface (43 pins), Cyusb3314_Power (54 pins), LED_Driver - 1 (53 pins), LED_Driver - 2 (47 pins), LED_Driver - 3 (47 pins), LED_Driver - 4 (47 pins)
RXVDDQ: Cyusb3014 - 2 (C79.2 C80.1 L7.2 U4.A2), Cyusb3014 - 4 (C159.2 C160.1 L15.2 U10.A2)
SWD_IO: Power (6 pins), Cyusb3014 - 2 (37 pins), Cyusb3014 - 4 (37 pins), Cyusb3314_Indicator (33 pins), Cyusb3314_Interface (8 pins), Cyusb3314_Power (18 pins)
TXVDDQ: Cyusb3014 - 2 (C66.2 C68.1 L8.2 U4.B5), Cyusb3014 - 4 (C145.2 C147.1 L16.2 U10.B5)
VCC(+5V): Power (6 pins), Cyusb3014 - 2 (C48.1 U4.E11), Cyusb3014 - 4 (C128.1 U10.E11), Cyusb3314_Indicator (6 pins), Cyusb3314_Interface (DPR1.3 DPR2.1 J24.2), LED_Driver - 1 (15 pins), LED_Driver - 2 (15 pins), LED_Driver - 3 (15 pins), LED_Driver - 4 (15 pins)
VCC_9V: Power (U21.3), LED_Driver - 1 (15 pins), LED_Driver - 2 (13 pins), LED_Driver - 3 (13 pins), LED_Driver - 4 (13 pins)
NetC188_1: Cyusb3314_Indicator (J11.10), Cyusb3314_Interface (C188.1 R121.1 SW10.2 U13.37)
NetJ11_4: Cyusb3314_Indicator (J11.4), Cyusb3314_Interface (R116.2 U13.27)
USB_DS2_DM: Cyusb3014 - 2 (U4.A10), Cyusb3314_Interface (U13.77 U83.2)
USB_DS2_DP: Cyusb3014 - 2 (U4.A9), Cyusb3314_Interface (U13.76 U83.1)
USB_DS2_RXM: Cyusb3014 - 2 (U4.A4), Cyusb3314_Interface (U13.54 U84.2)
USB_DS2_RXP: Cyusb3014 - 2 (U4.A3), Cyusb3314_Interface (U13.55 U84.1)
USB_DS2_TXM: Cyusb3014 - 2 (C67.1), Cyusb3314_Interface (C175.1 U85.2)
USB_DS2_TXP: Cyusb3014 - 2 (C63.1), Cyusb3314_Interface (C176.1 U85.1)
USB_DS4_DM: Cyusb3014 - 4 (U10.A9), Cyusb3314_Interface (U13.82)
USB_DS4_DM: Cyusb3014 - 4 (U10.A10), Cyusb3314_Interface (U13.81)
USB_DS4_RXM: Cyusb3014 - 4 (U10.A4), Cyusb3314_Interface (U13.19)
USB_DS4_RXP: Cyusb3014 - 4 (U10.A3), Cyusb3314_Interface (U13.20)
USB_DS4_TXM: Cyusb3014 - 4 (C148.1), Cyusb3314_Interface (C189.1)
USB_DS4_TXP: Cyusb3014 - 4 (C146.1), Cyusb3314_Interface (C190.1)